# EasyEDA Pro project ProPrj_承载我所有幻想的键盘_2025-02-09.epro, schematic 09-Schematic

## Sheets
1 ESP32主控: Create Date: 2024-07-23; Page Name: ESP32主控; Project Name: 智能旋钮; Schematic Name: 主控板_小功率_S3_3; Update Date: 2024-07-23; Company: 嘉立创EDA
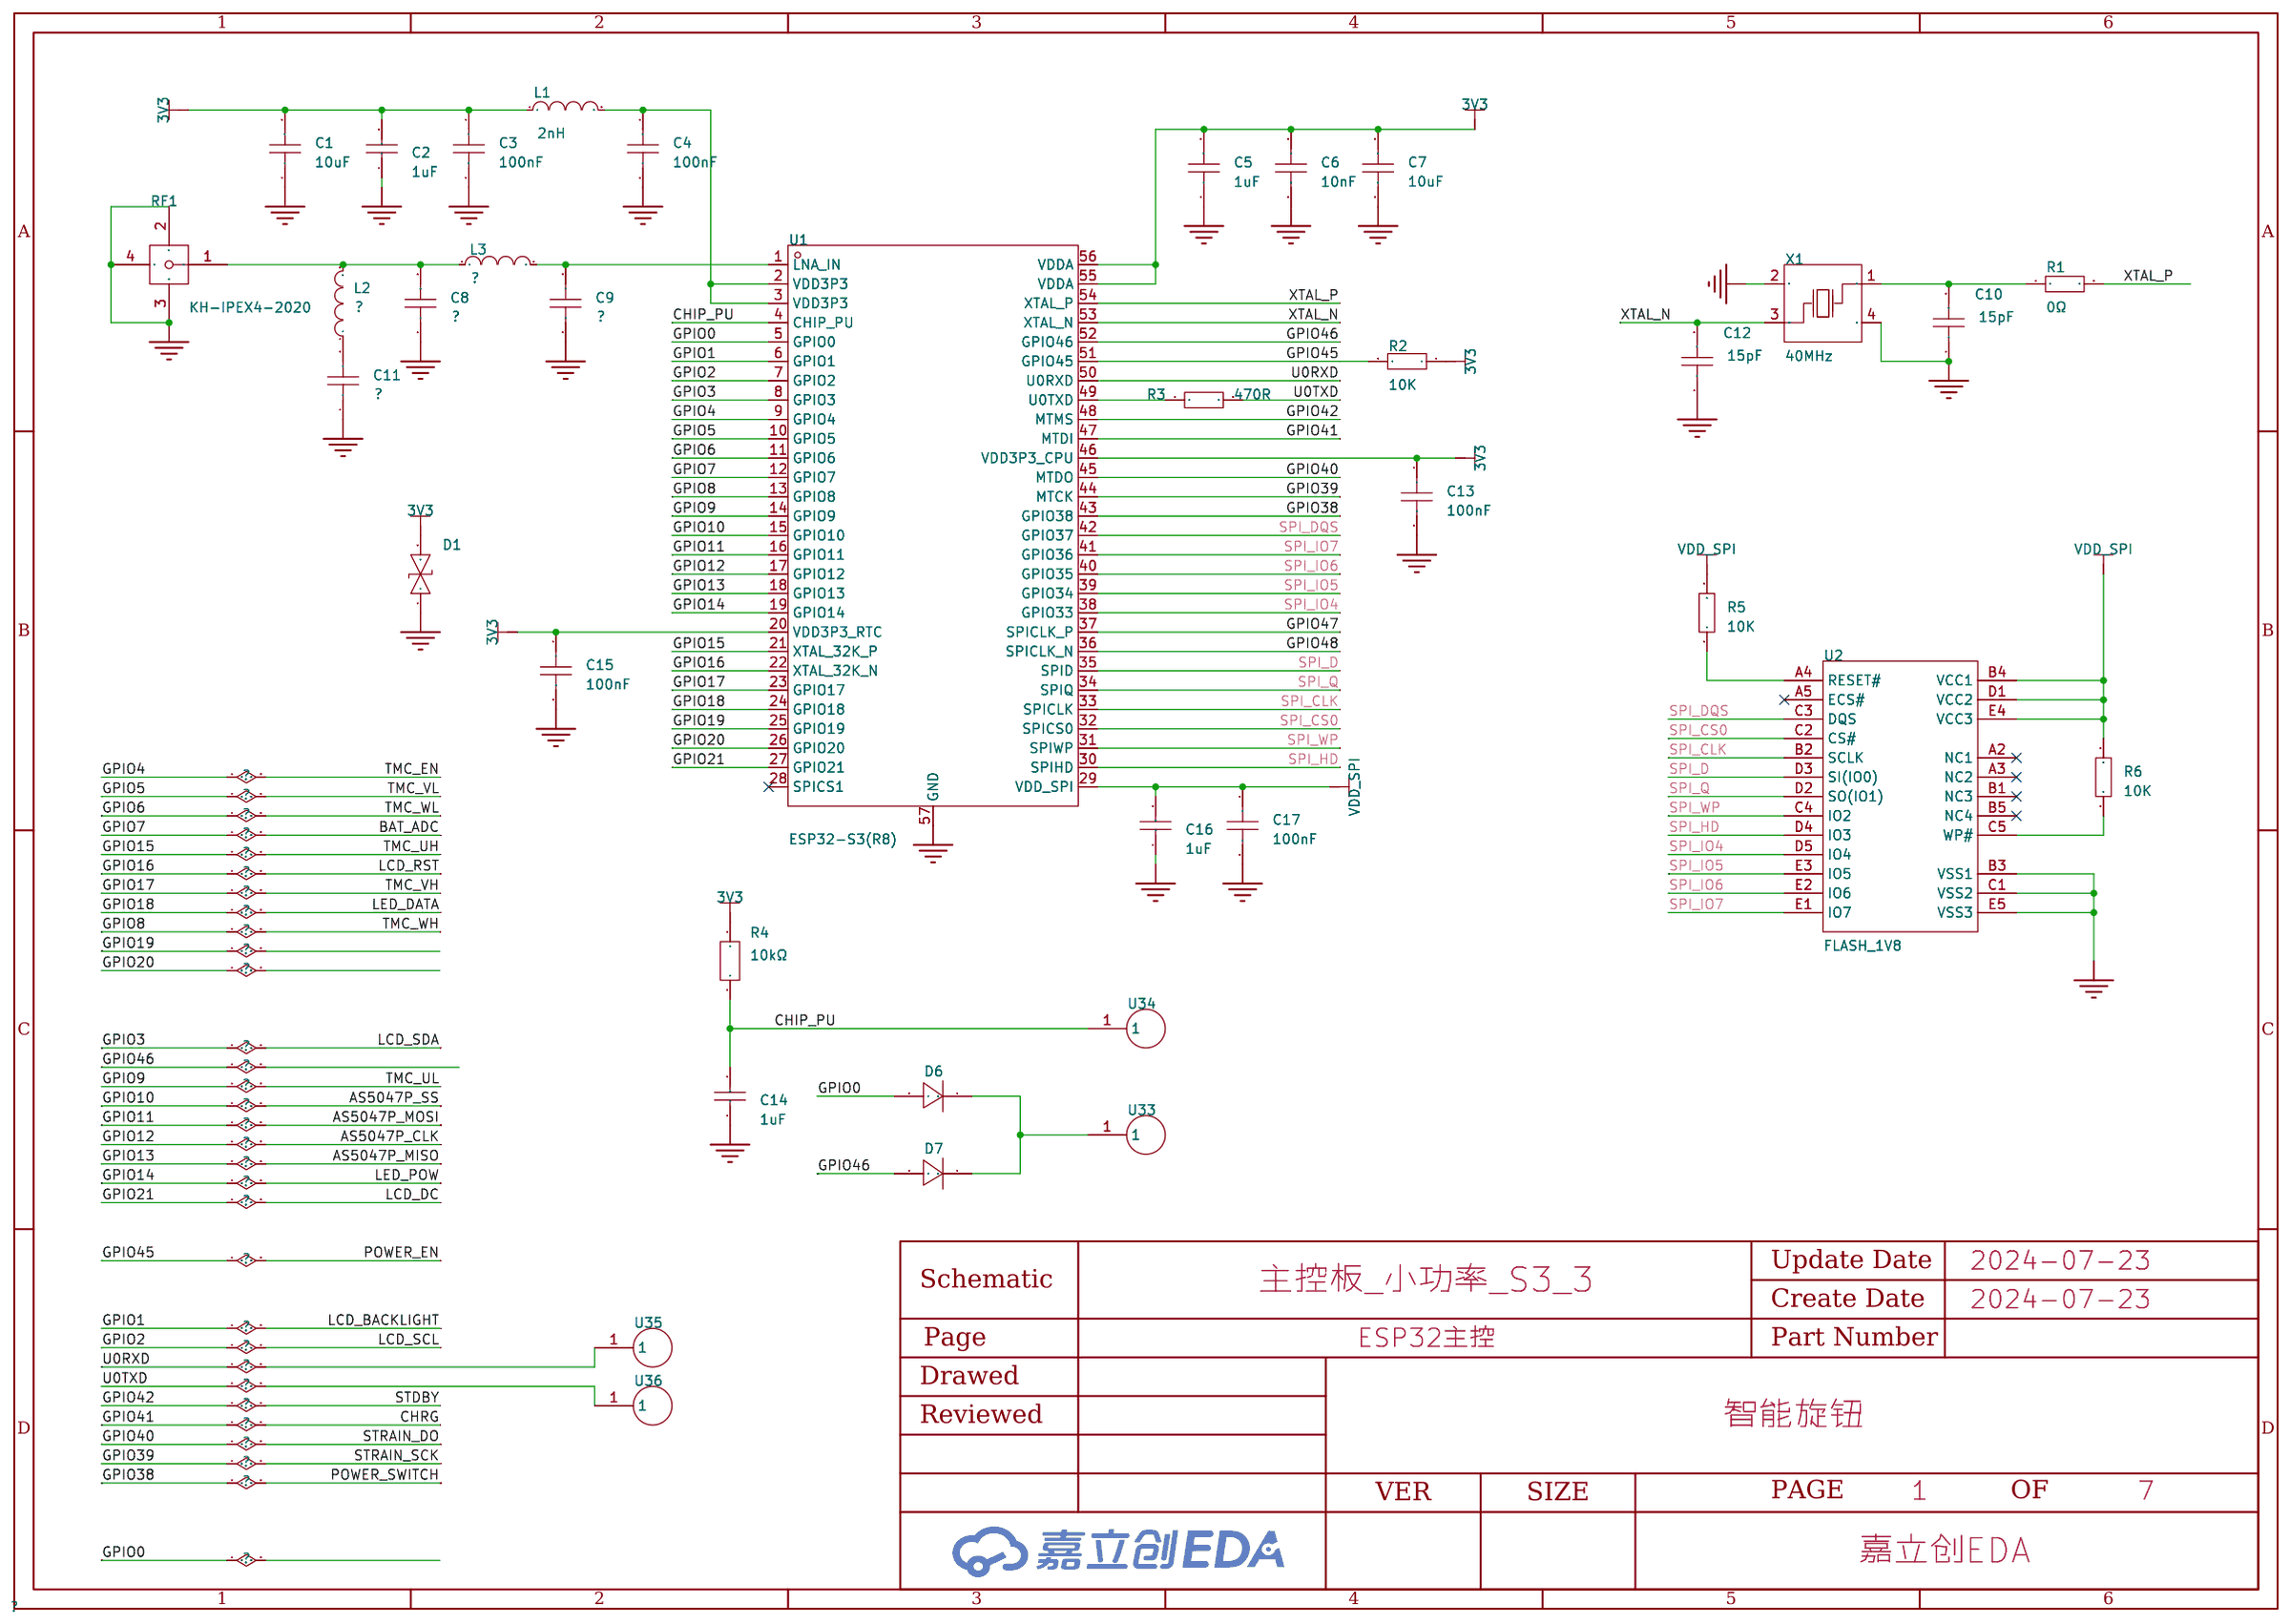
[diagram p16: ESP32主控]
2 FOC无刷电机驱动: Create Date: 2024-03-25; Page Name: FOC无刷电机驱动; Schematic Name: 主控板_小功率_S3_2; Update Date: 2024-03-25
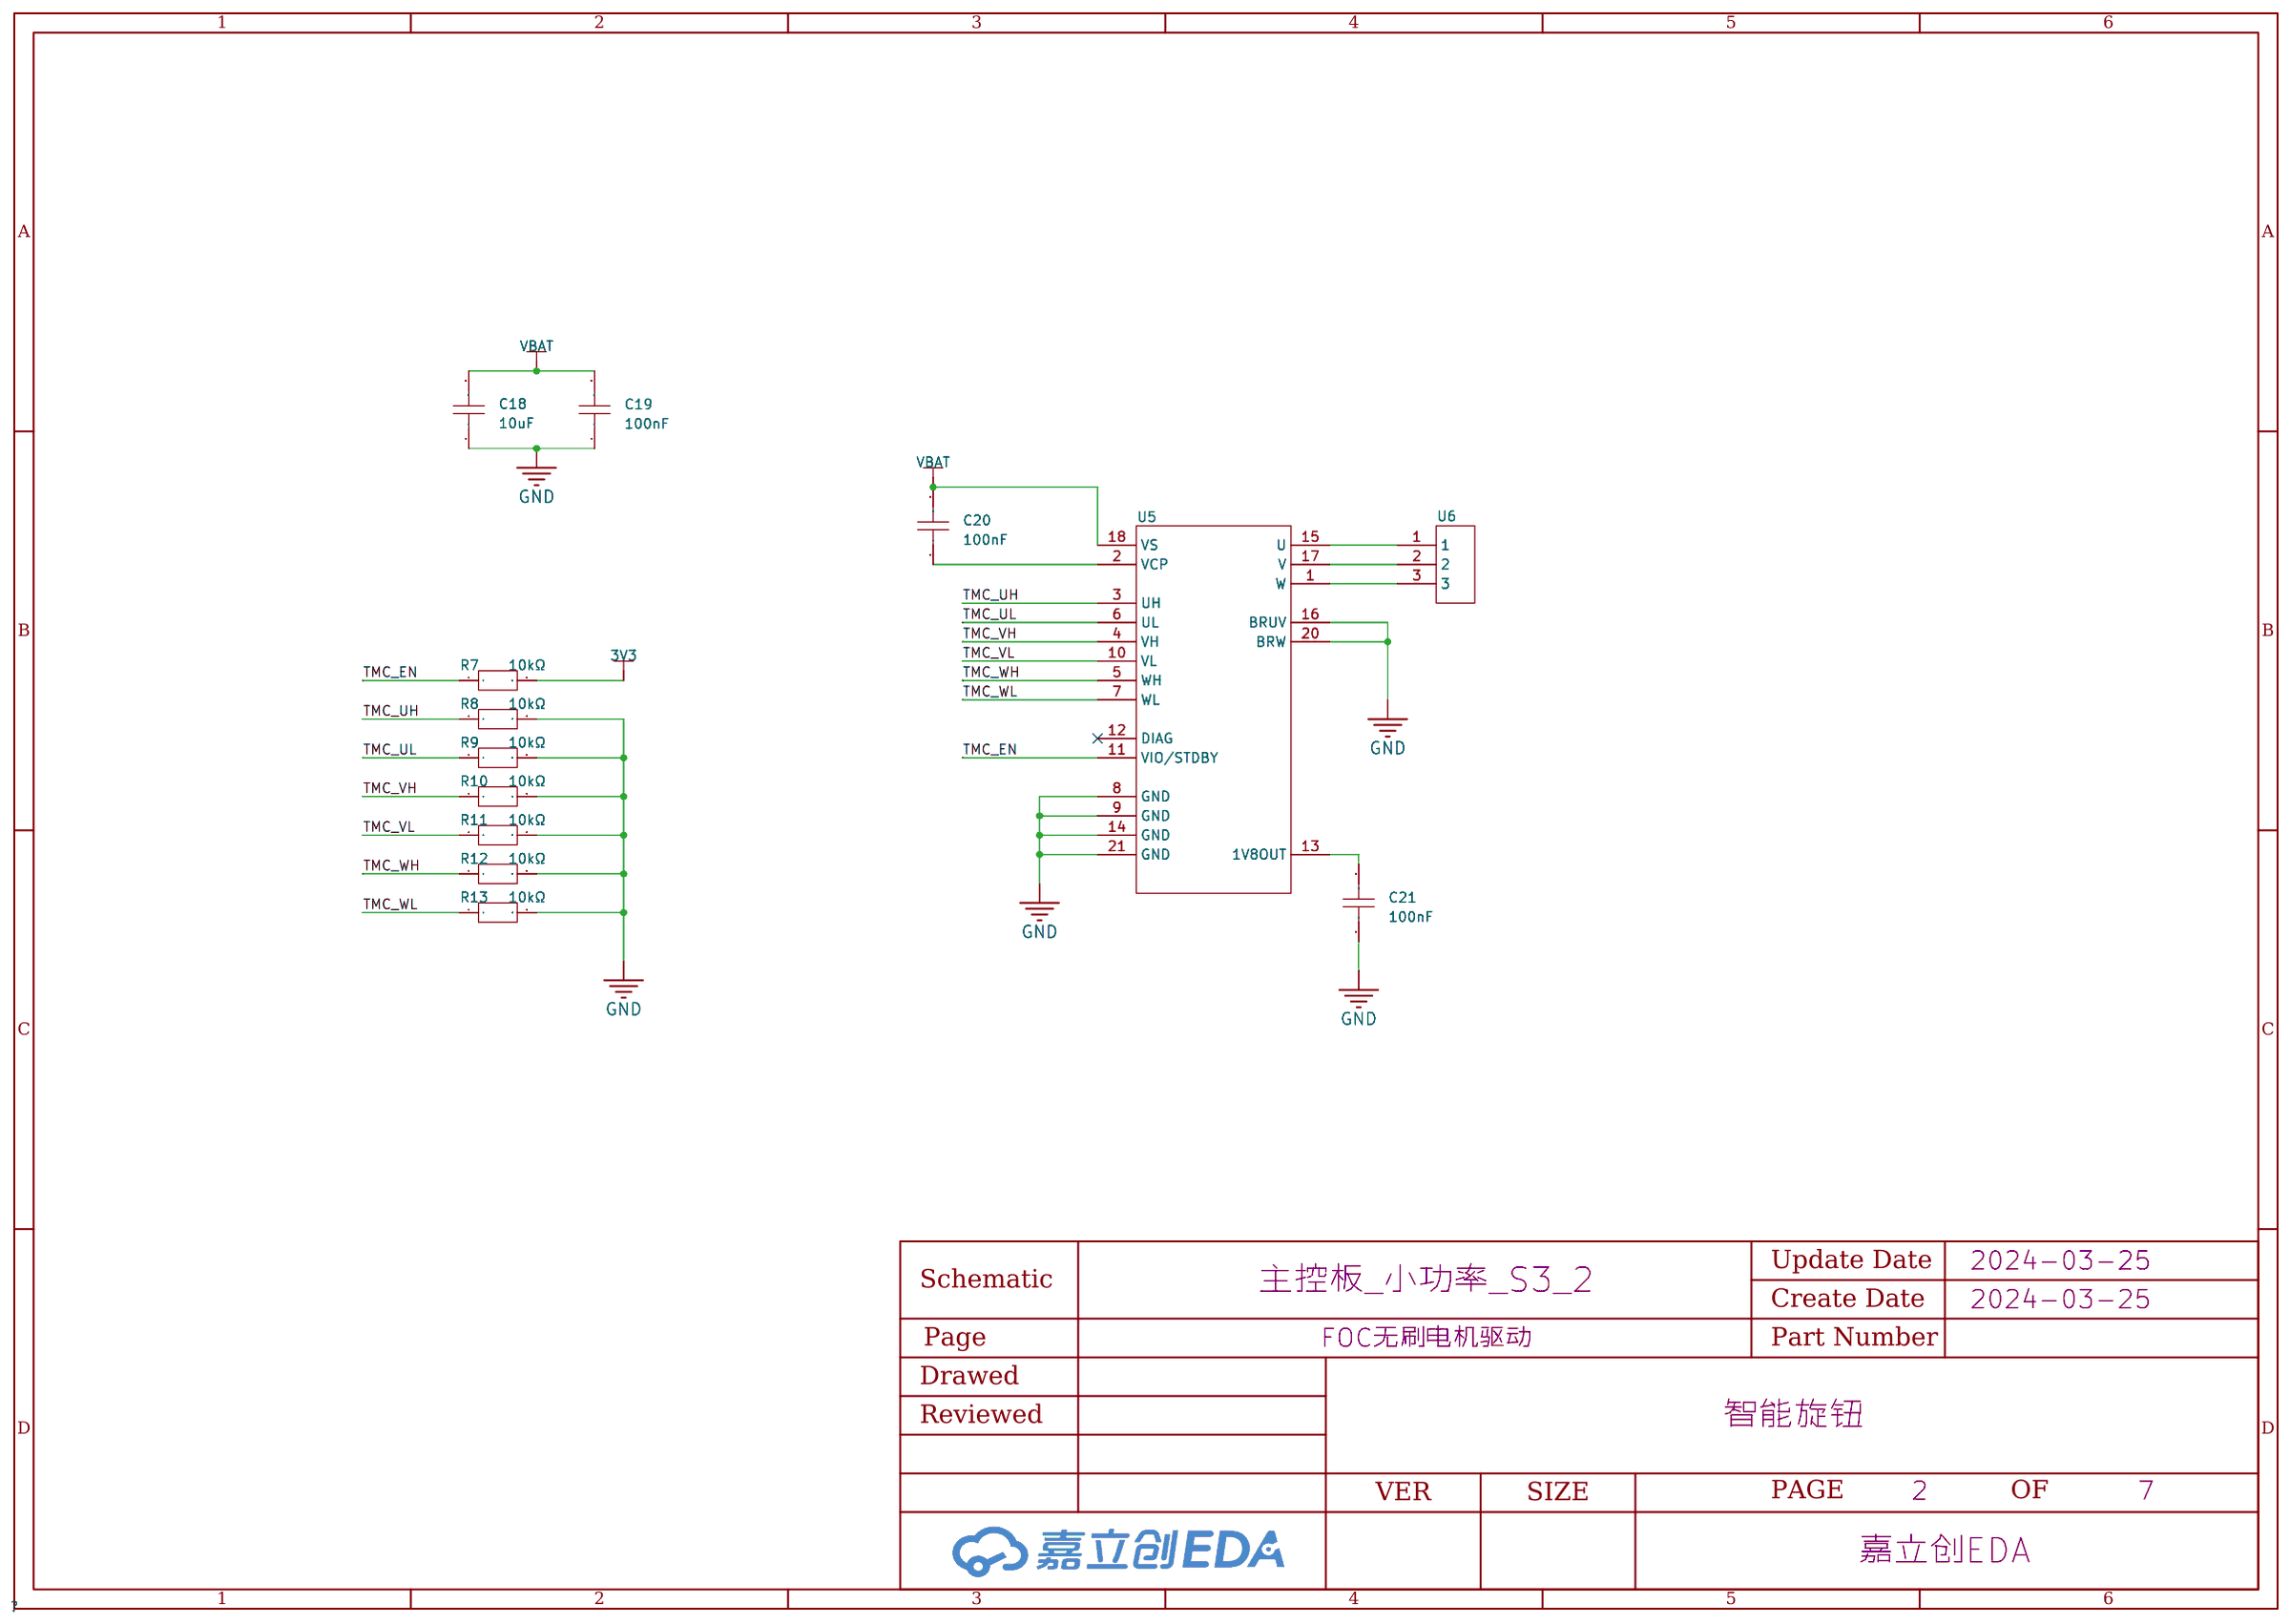
[diagram p17: FOC无刷电机驱动]
3 显示: Create Date: 2024-03-25; Page Name: 显示; Schematic Name: 主控板_小功率_S3_2; Update Date: 2024-04-06
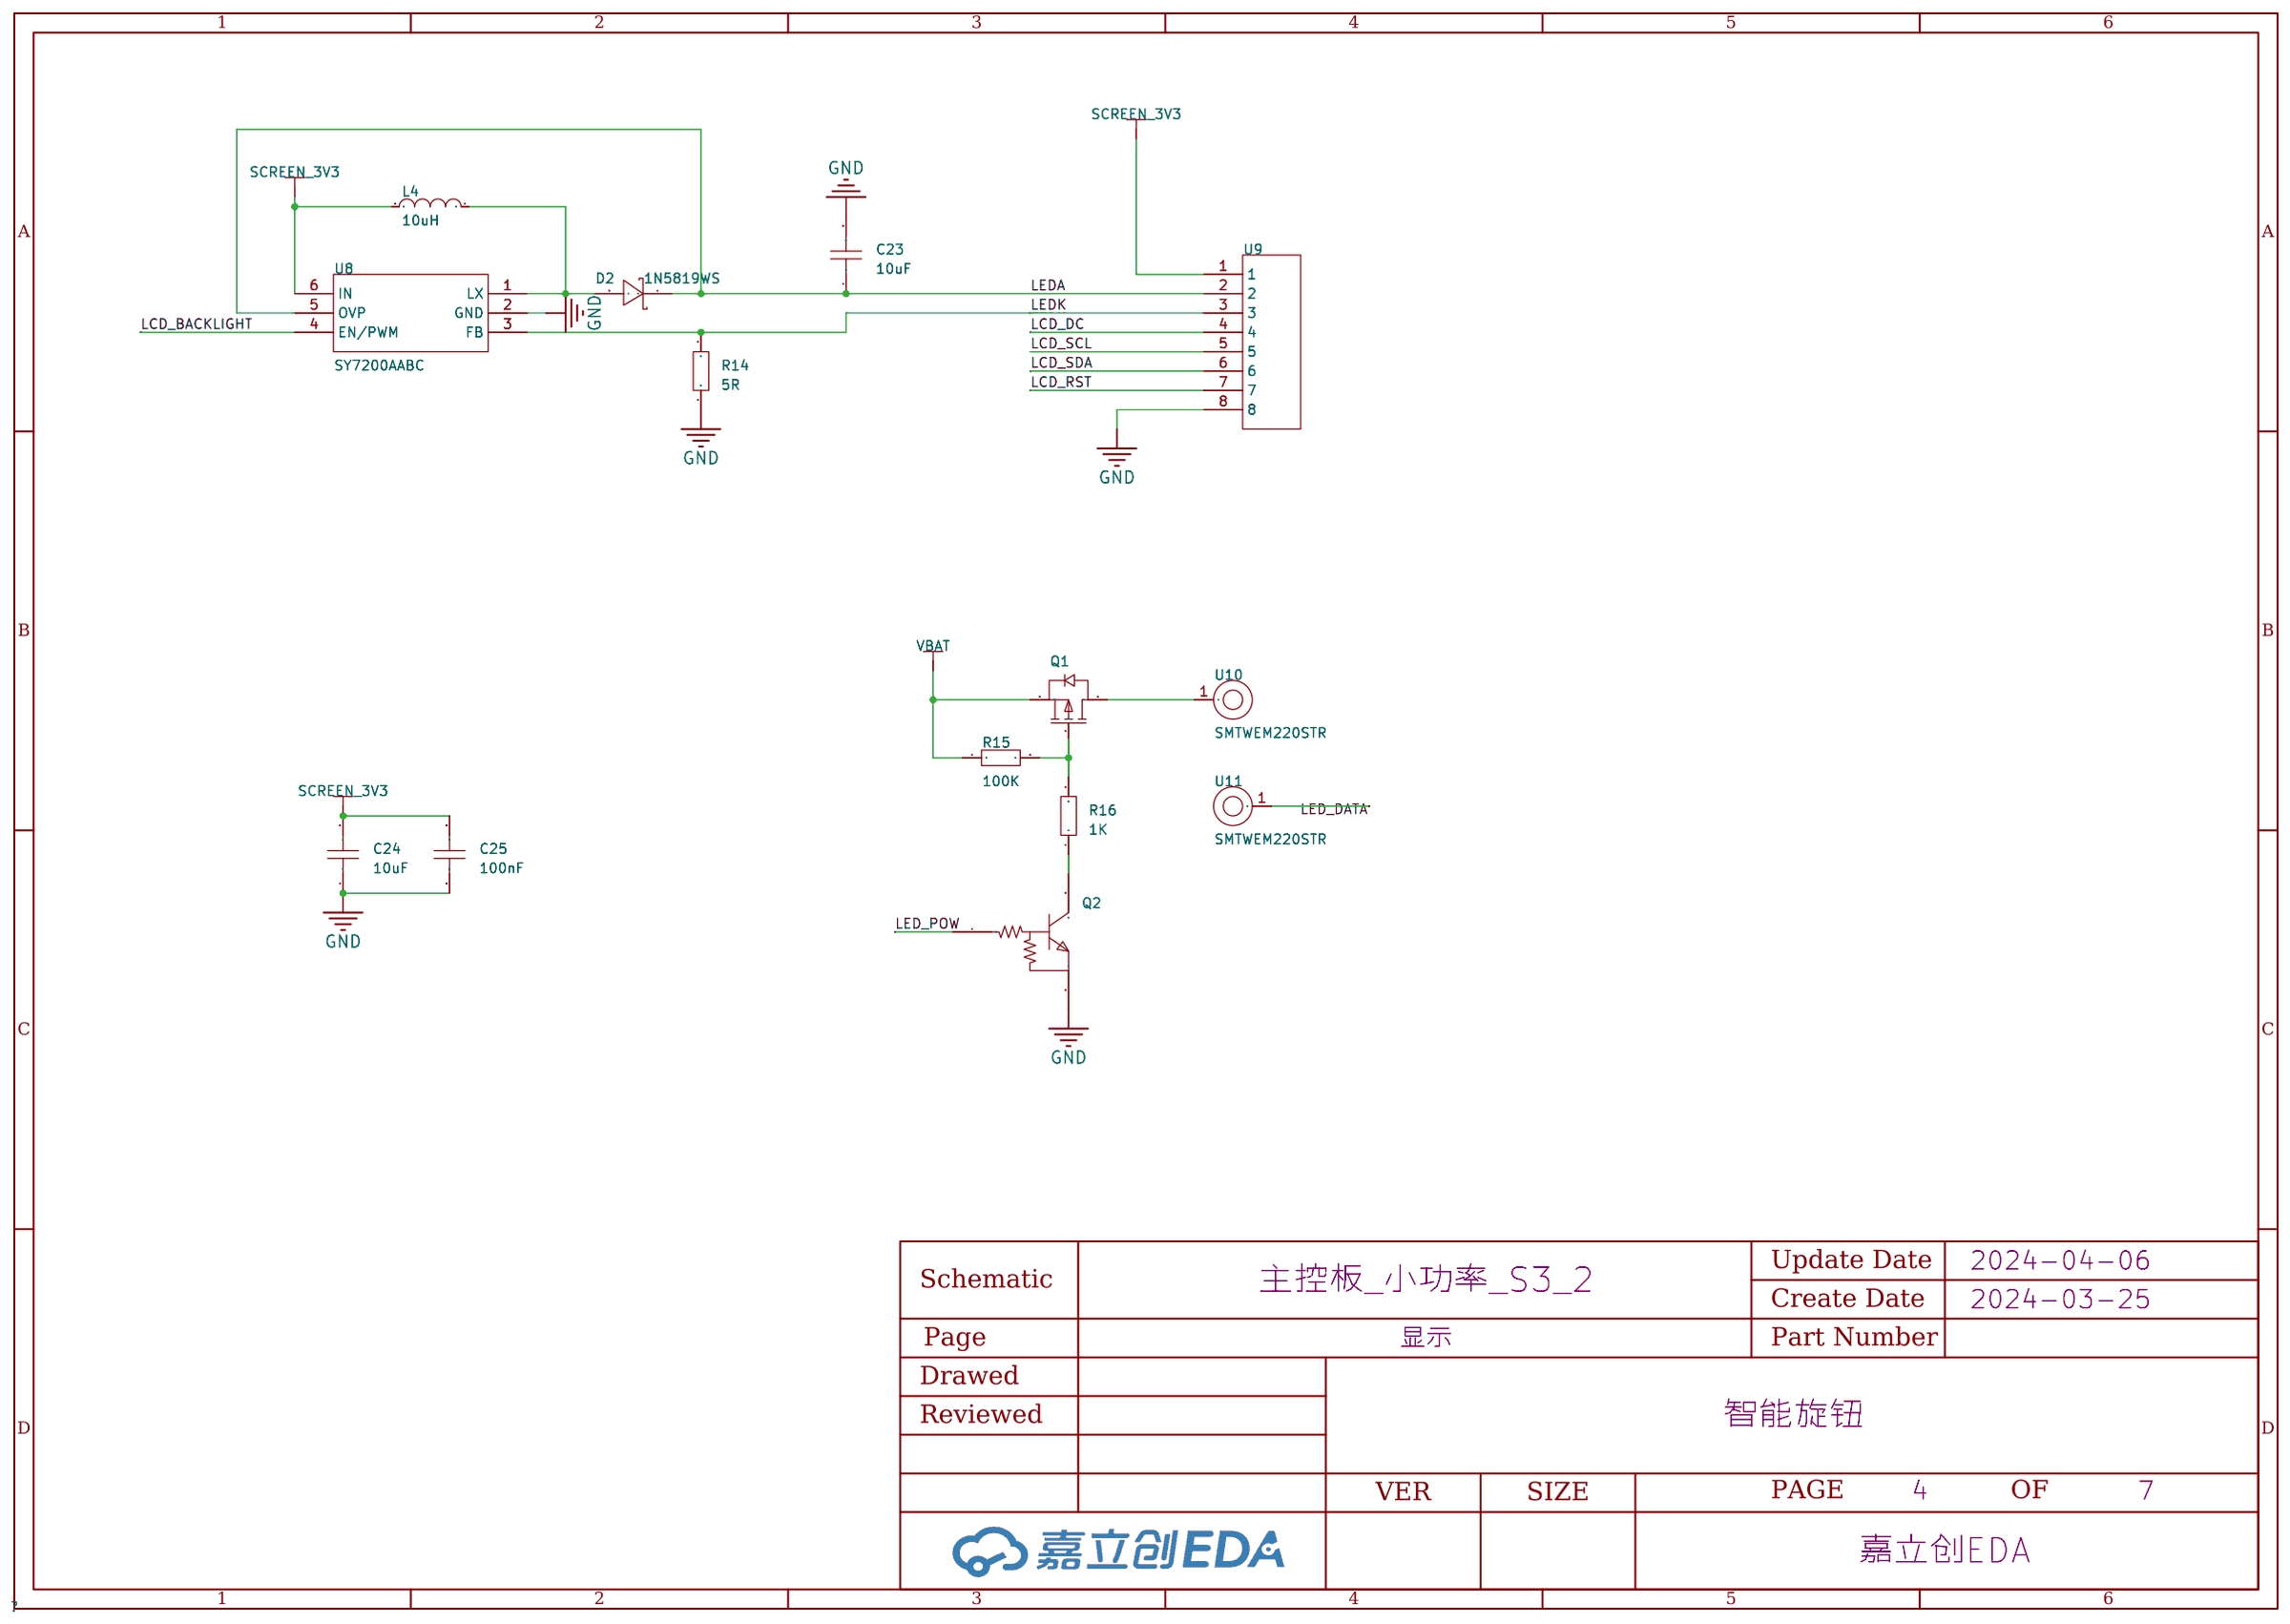
[diagram p18: 显示]
4 电源: Create Date: 2024-08-04; Page Name: 电源; Project Name: 承载我所有幻想的键盘; Schematic Name: 09-Schematic; Update Date: 2024-08-04
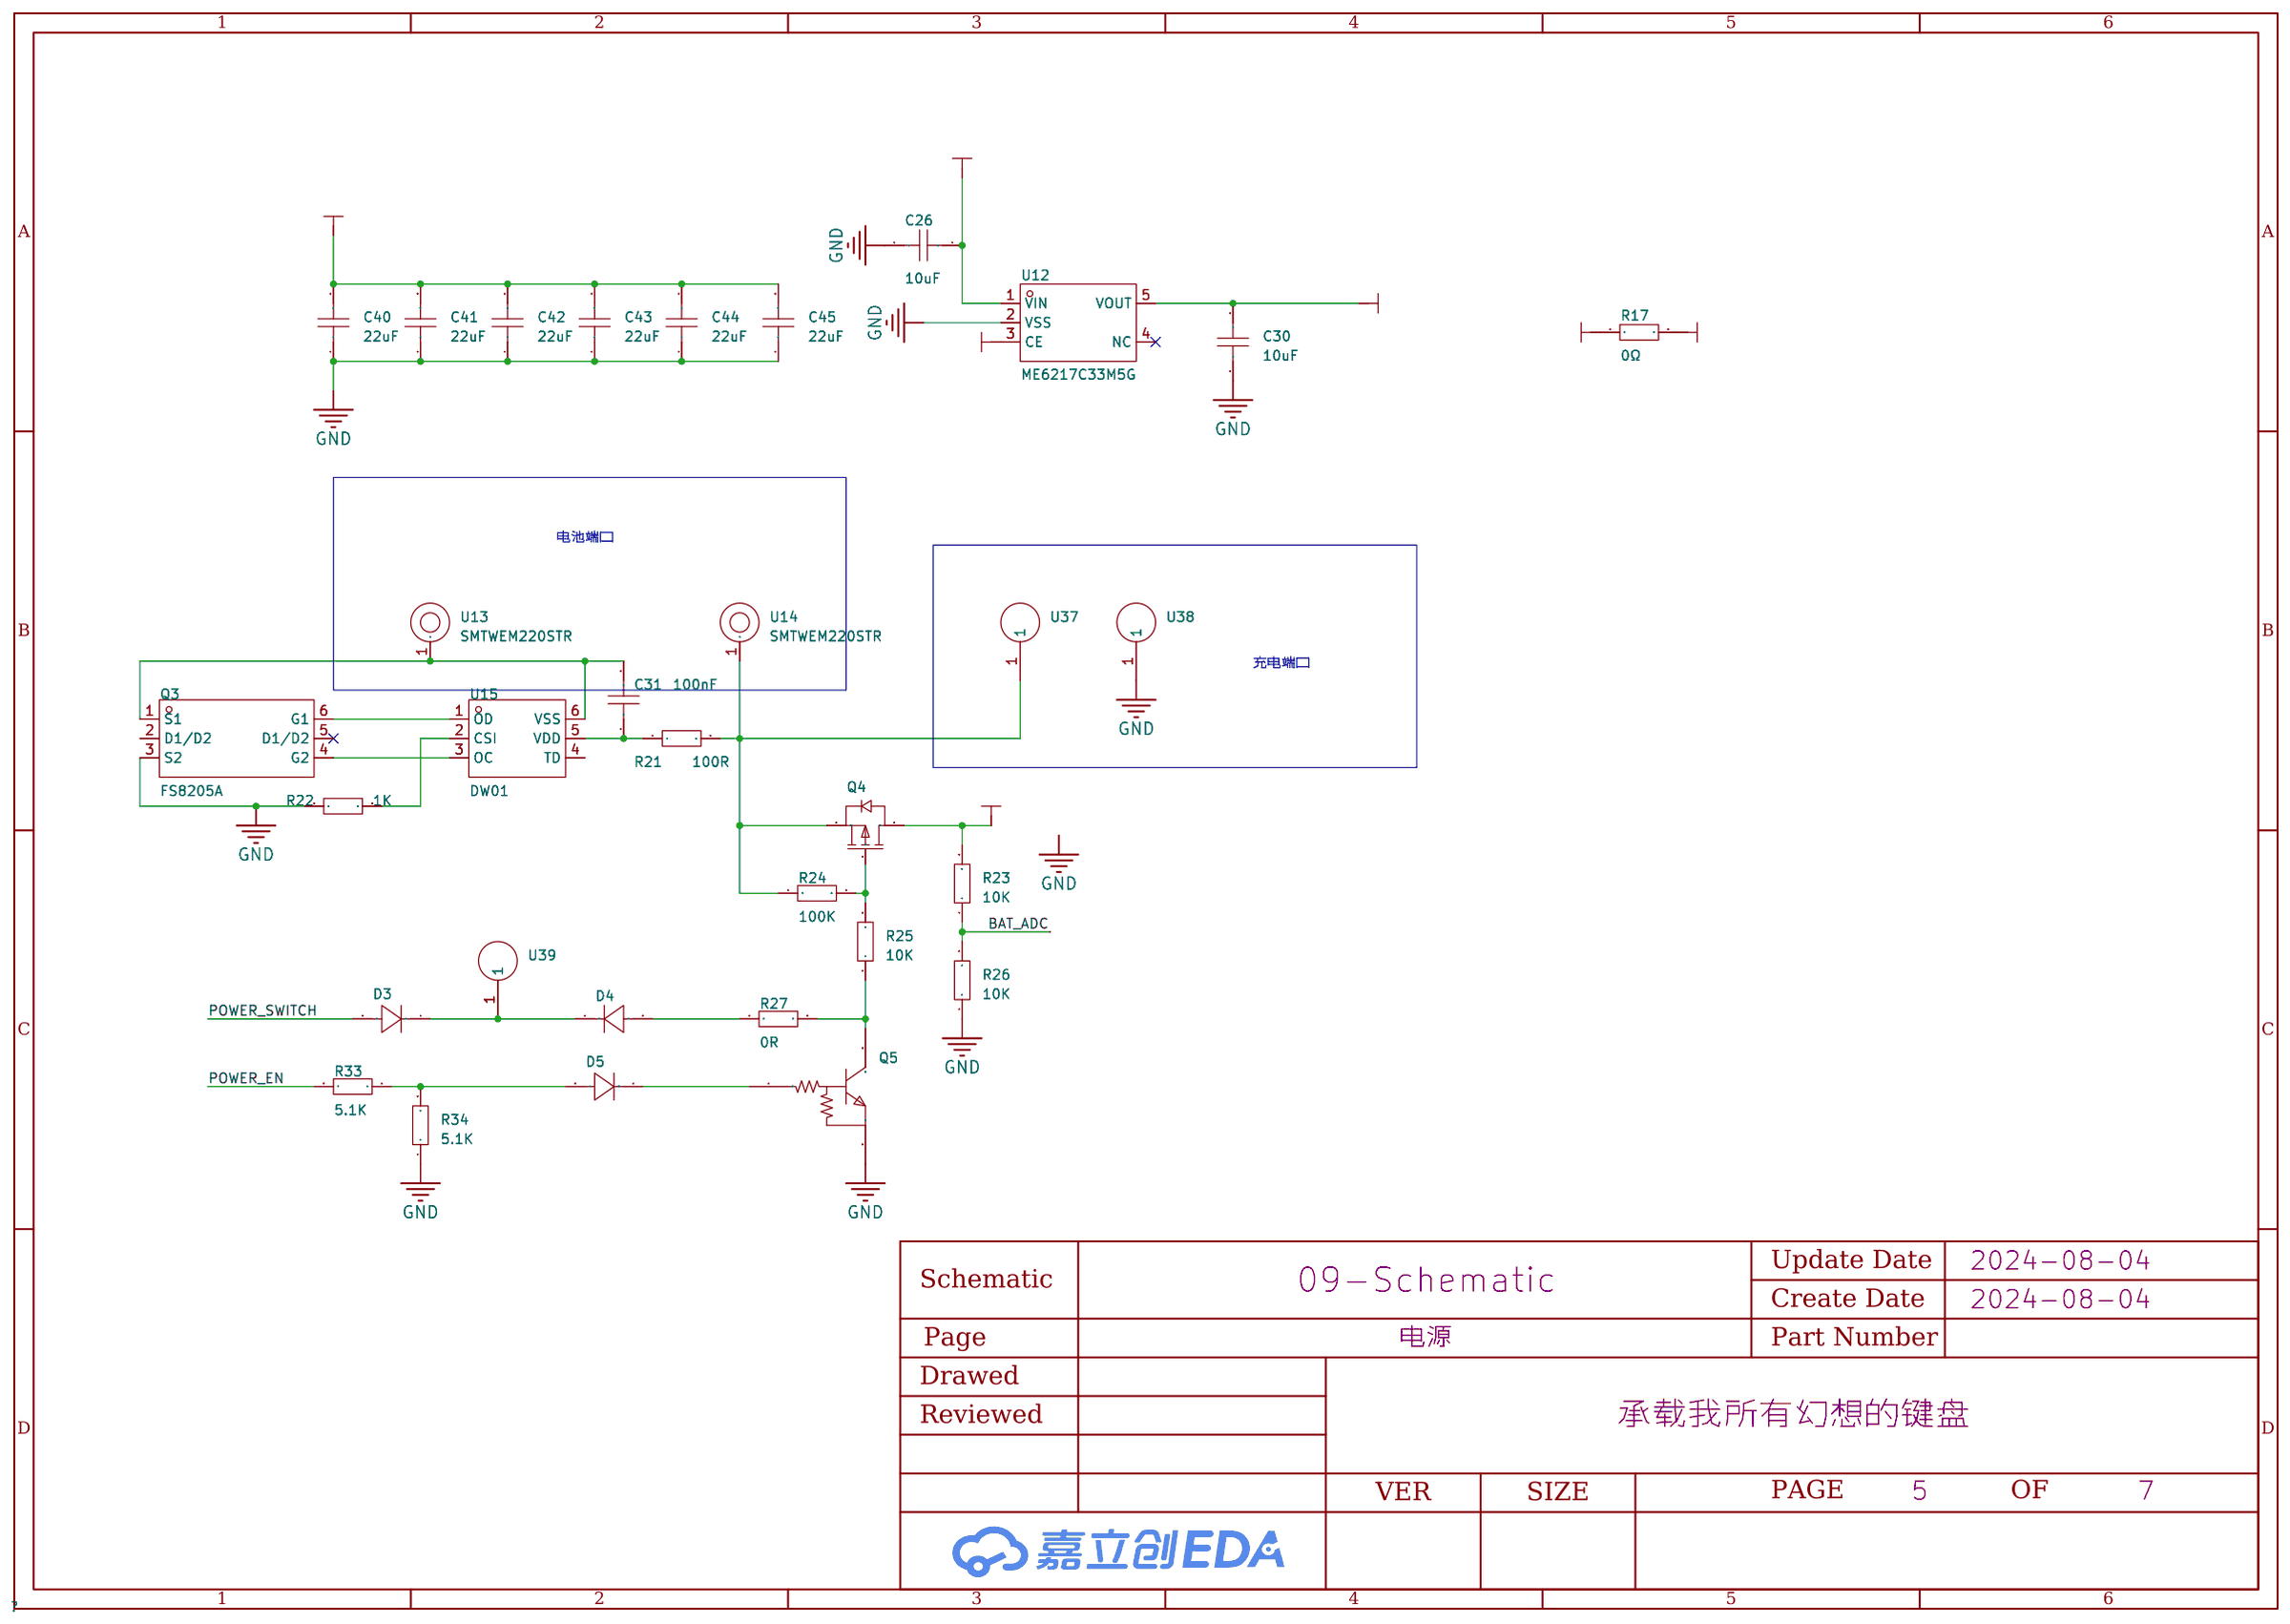
[diagram p19: 电源]
5 编码器: Create Date: 2024-03-25; Page Name: 编码器; Schematic Name: 主控板_小功率_S3_2; Update Date: 2024-03-25
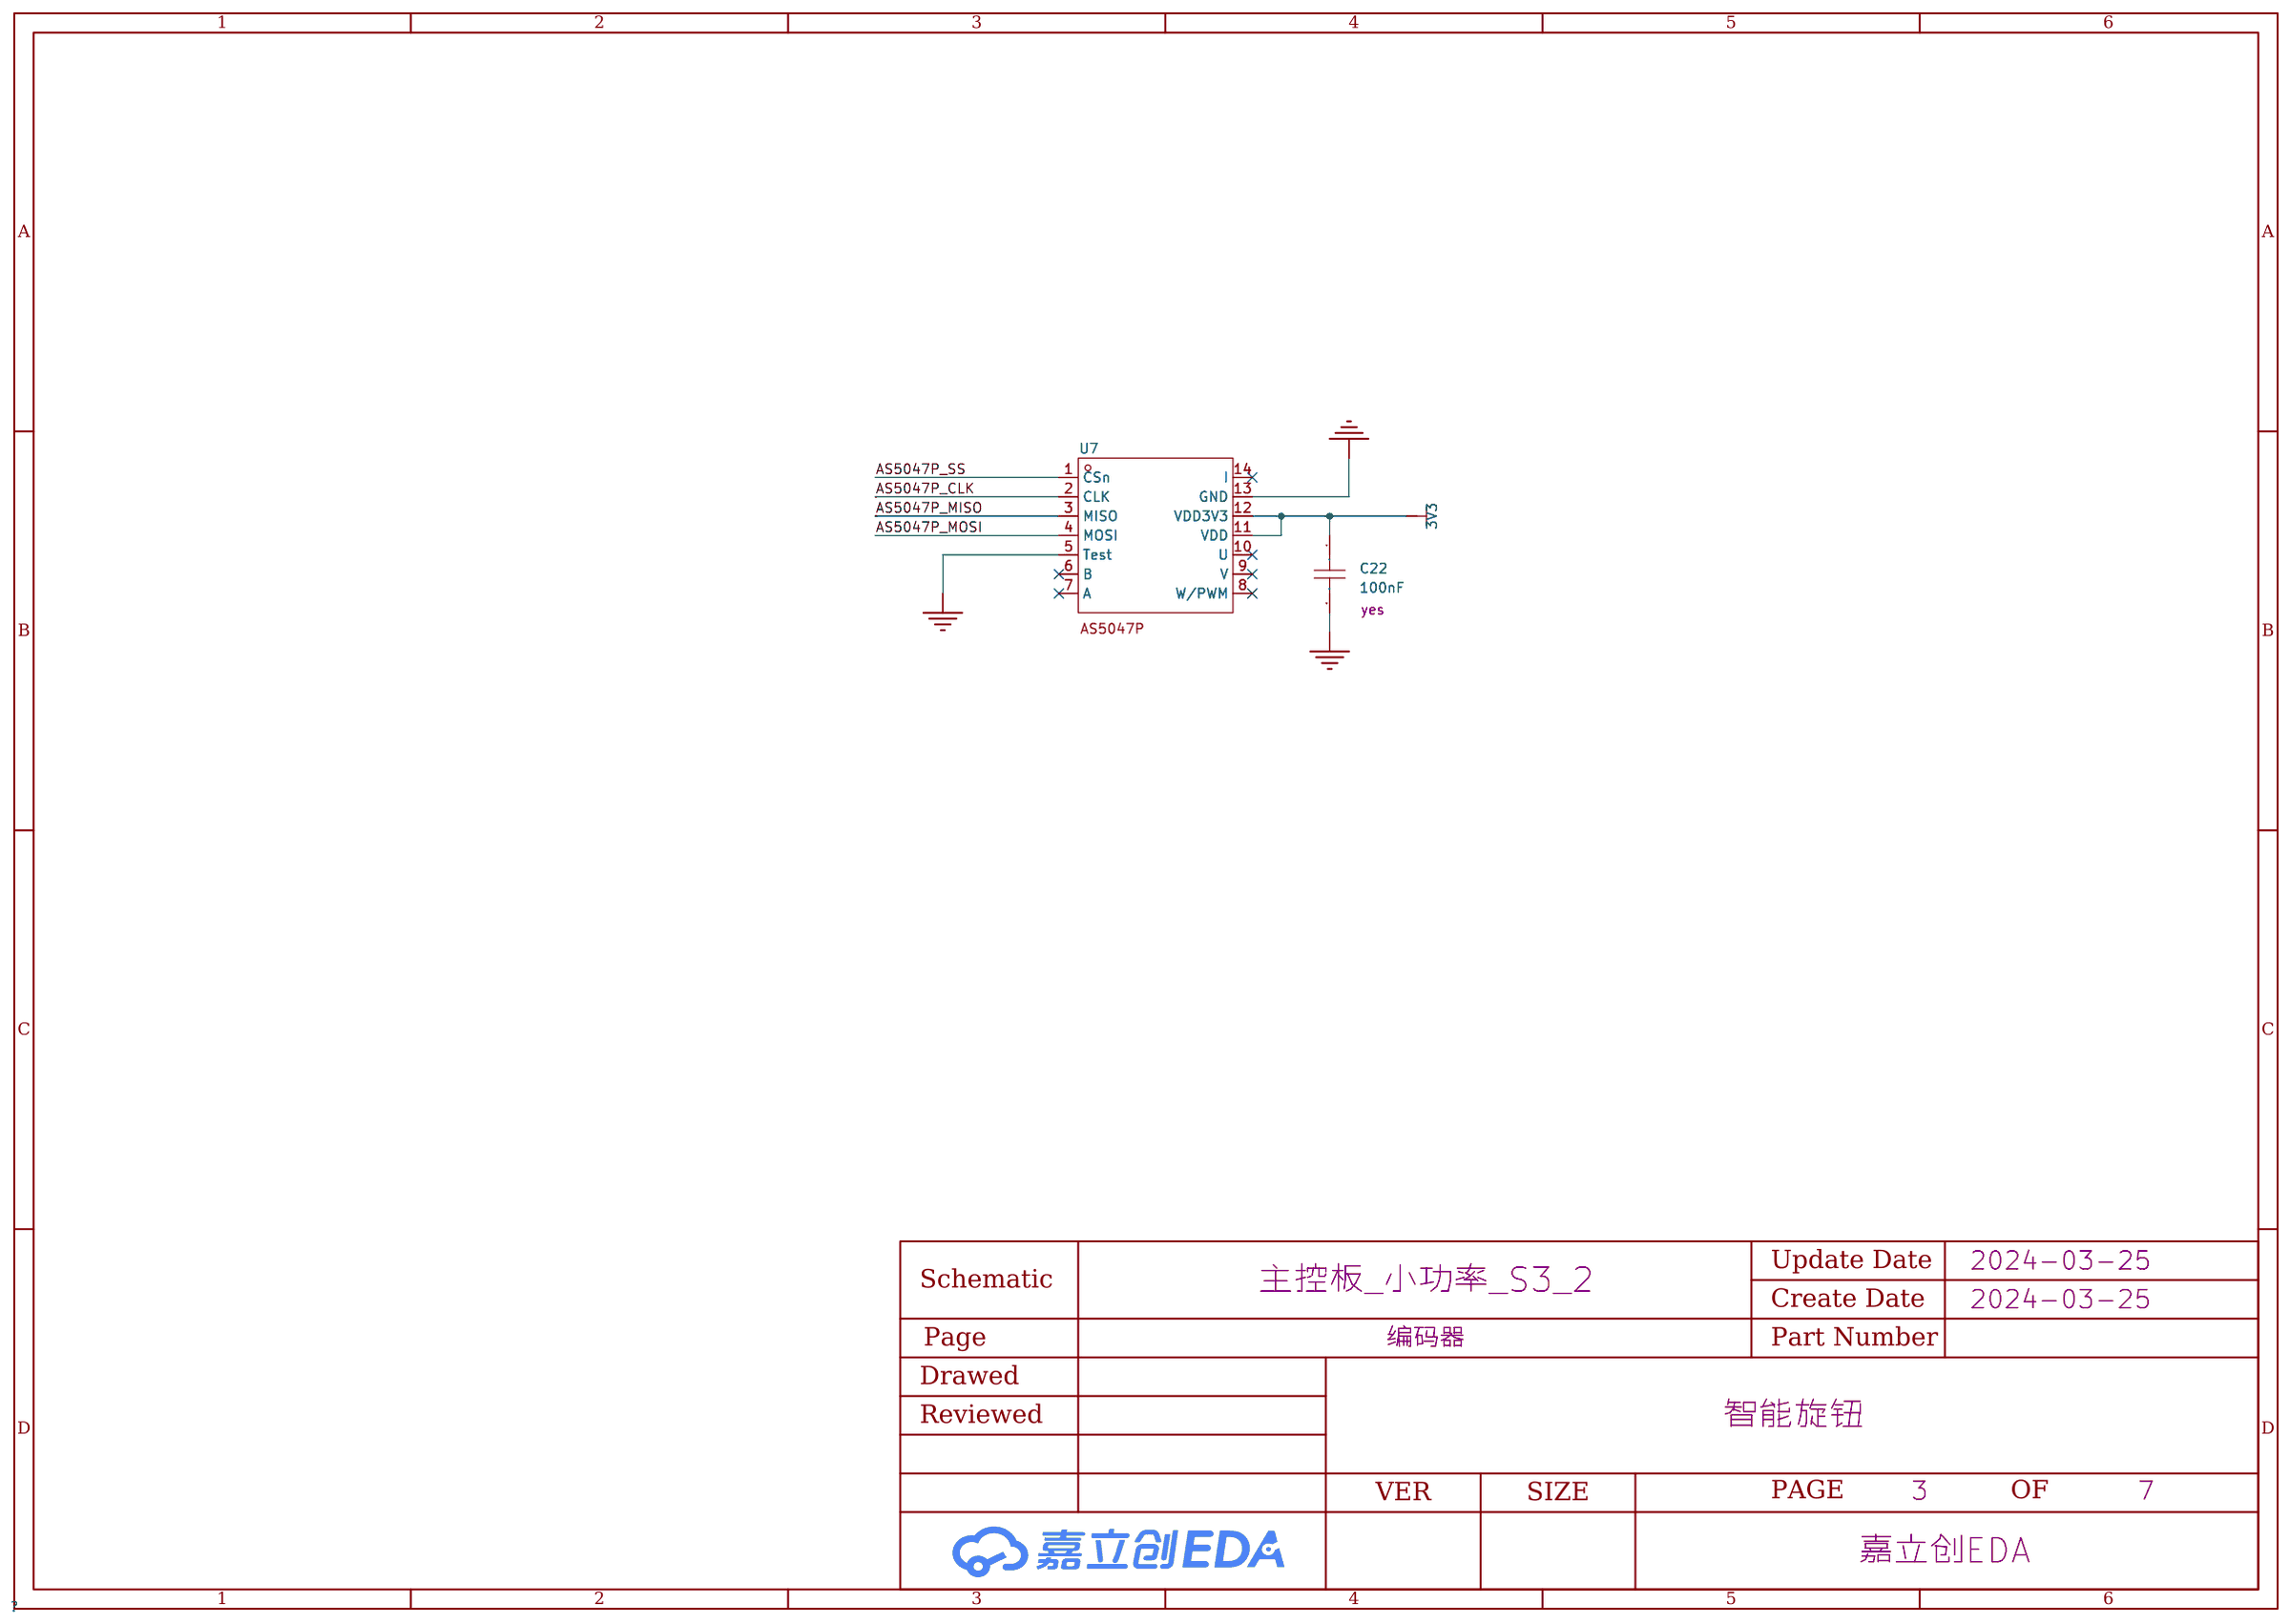
[diagram p20: 编码器]
6 压力传感器: Create Date: 2024-03-25; Page Name: 压力传感器; Schematic Name: 主控板_小功率_S3_2; Update Date: 2024-03-25
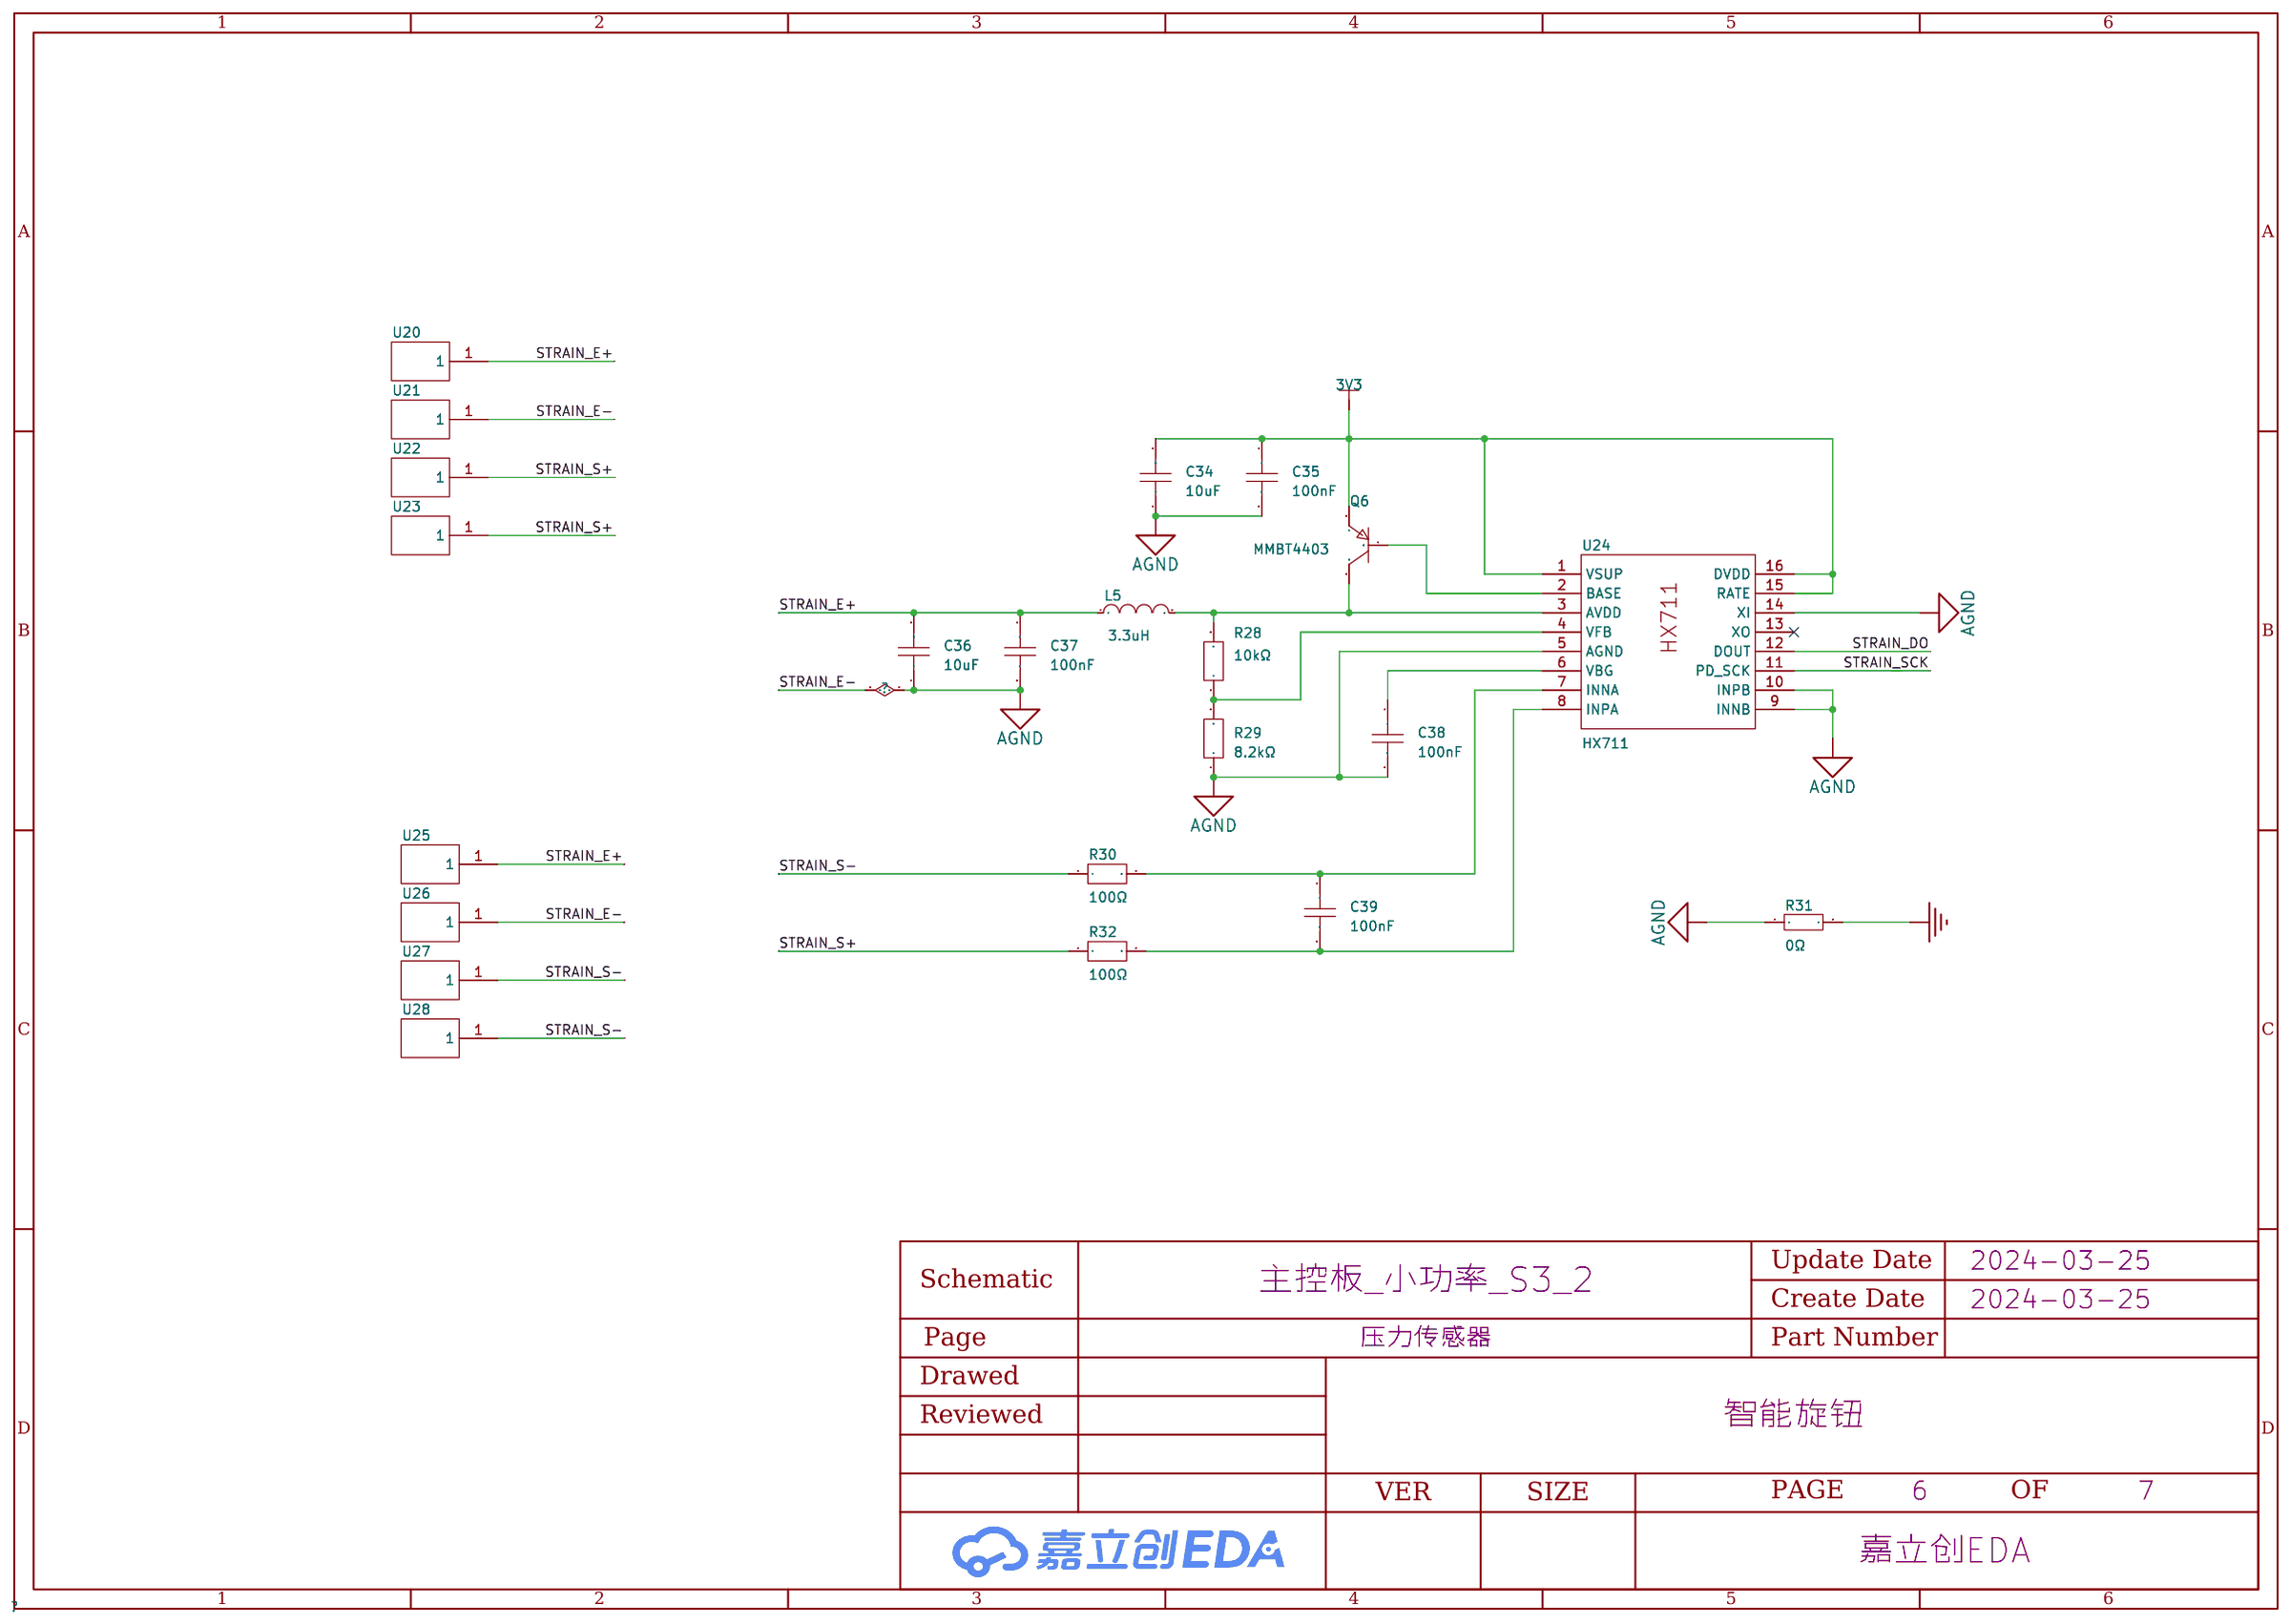
[diagram p21: 压力传感器]
7 3D外壳: Create Date: 2024-08-04; Page Name: 3D外壳; Project Name: 承载我所有幻想的键盘; Schematic Name: 09-Schematic; Update Date: 2024-08-04
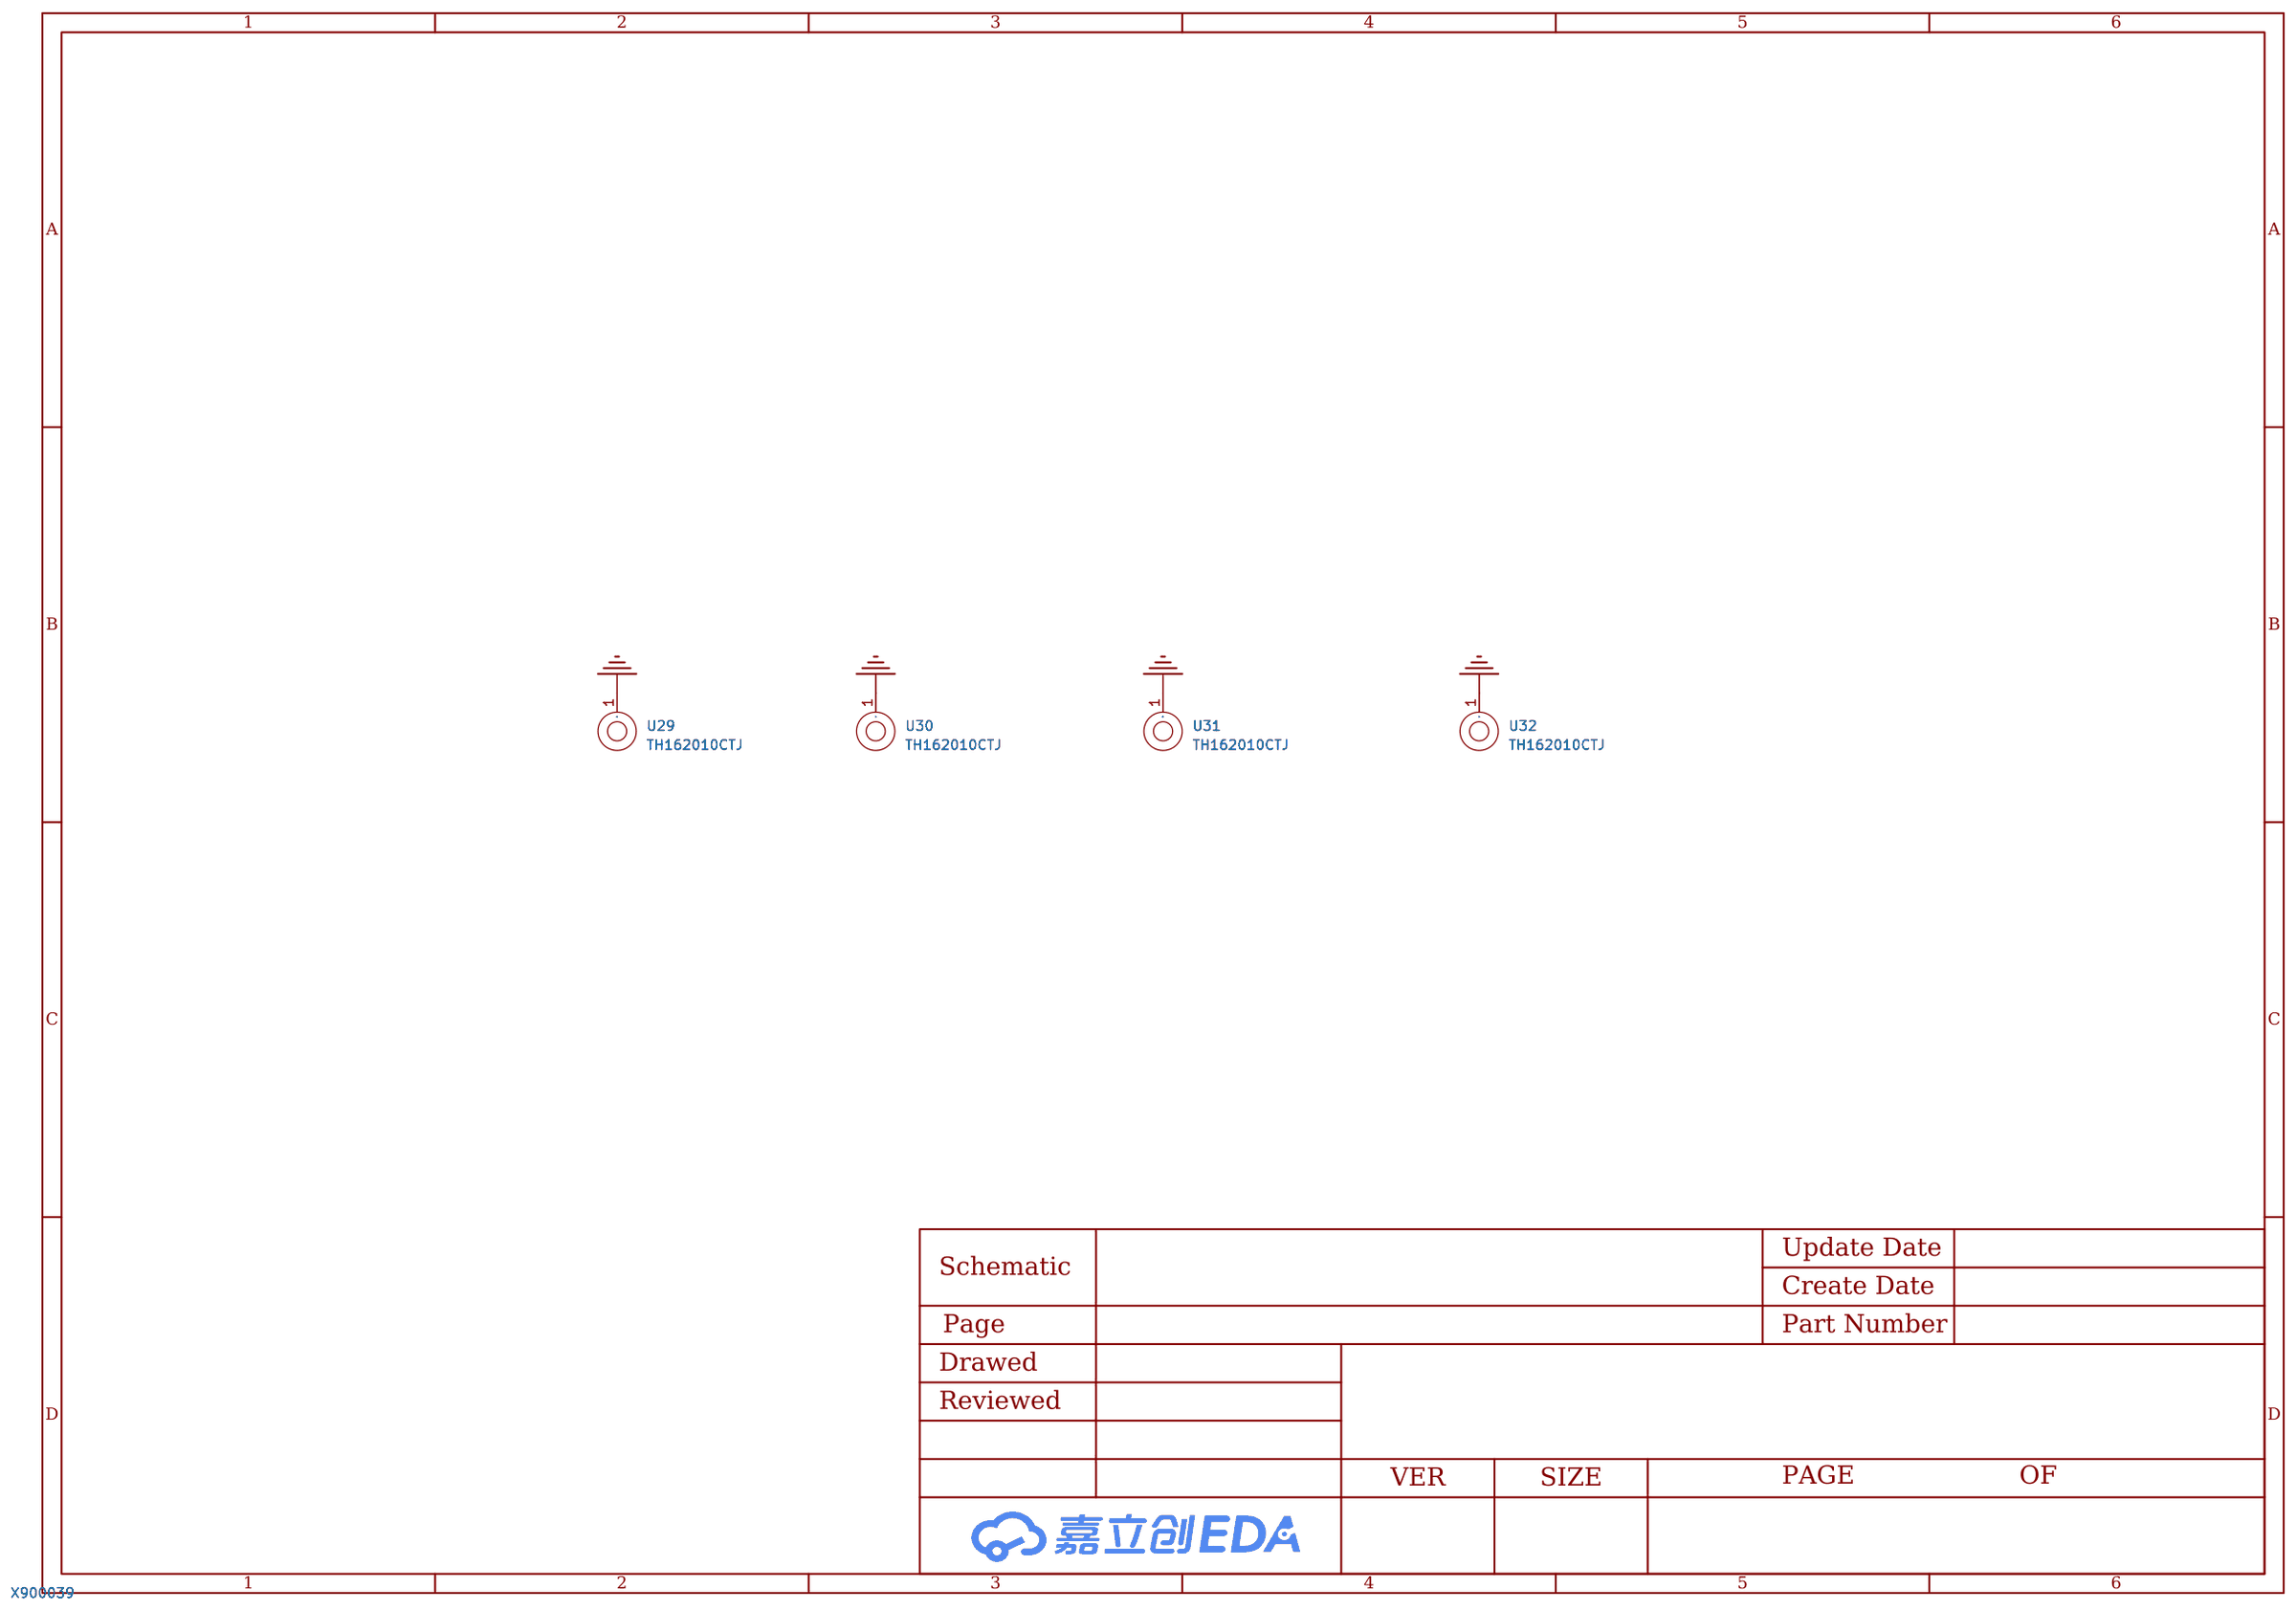
[diagram p22: 3D外壳]

## Parts
sheet 3D外壳
U29  TH162010CTJ  [SMD-1_BD4.4-D2.8]
U30  TH162010CTJ  [SMD-1_BD4.4-D2.8]
U31  TH162010CTJ  [SMD-1_BD4.4-D2.8]
U32  TH162010CTJ  [SMD-1_BD4.4-D2.8]
sheet ESP32主控
C1  10uF  [C0402]
C2  1uF  [C0201]
C3  100nF  [C0201]
C4  100nF  [C0201]
C5  1uF  [C0402]
C6  10nF  [C0402]
C7  10uF  [C0402]
C8  ？  [C0201]
C9  ？  [C0201]
C10  15pF  [C0402]
C11  ？  [C0201]
C12  15pF  [C0402]
C13  100nF  [C0402]
C14  1uF  [C0402]
C15  100nF  [C0402]
C16  1uF  [C0402]
C17  100nF  [C0402]
D1  LESD8D3.3CAT5G  [SOD-882_L1.0-W0.6-BI]
D6  1N4148WT  [SOD-523_L1.2-W0.8-LS1.6-RD]
D7  1N4148WT  [SOD-523_L1.2-W0.8-LS1.6-RD]
L1  2nH  [L0201]
L2  ？  [L0201]
L3  ？  [L0201]
R1  0Ω  [R0402]
R2  10K  [R0402]
R3  470R  [R0402]
R4  10kΩ  [R0402]
R5  10K  [R0402]
R6  10K  [R0402]
RF1  KH-IPEX4-2020  [IPEX4-SMD_4P-L1.8-W1.7-LS2.0-L_KH-IPEX4-2020]
U1  ESP32-S3(R8)  [QFN-56_L7.0-W7.0-P0.40-TL-EP4.0]
U2  FLASH_1V8  [BGA25-6X8-1P0]
U33  -  [2MM POGPIN母座]
U34  -  [2MM POGPIN母座]
U35  -  [2MM POGPIN母座]
U36  -  [2MM POGPIN母座]
X1  40MHz  [OSC-SMD_4P-L3.2-W2.5-BL_SIT8008BI]
sheet FOC无刷电机驱动
C18  10uF  [C0402]
C19  100nF  [C0402]
C20  100nF  [C0402]
C21  100nF  [C0402]
R7  10kΩ  [R0402]
R8  10kΩ  [R0402]
R9  10kΩ  [R0402]
R10  10kΩ  [R0402]
R11  10kΩ  [R0402]
R12  10kΩ  [R0402]
R13  10kΩ  [R0402]
U5  -  [QFN-20_L3.0-W3.0-P0.50-BL-EP1.7]
U6  -  [3Pin焊接接口]
sheet 压力传感器
C34  10uF  [C0402]
C35  100nF  [C0402]
C36  10uF  [C0402]
C37  100nF  [C0402]
C38  100nF  [C0402]
C39  100nF  [C0402]
L5  3.3uH  [L0805]
Q6  MMBT4403  [SOT-23-3_L2.9-W1.3-P1.90-LS2.4-BR]
R28  10kΩ  [R0402]
R29  8.2kΩ  [R0402]
R30  100Ω  [R0402]
R31  0Ω  [R0402]
R32  100Ω  [R0402]
U20  -  [1P焊接接口]
U21  -  [1P焊接接口]
U22  -  [1P焊接接口]
U23  -  [1P焊接接口]
U24  HX711  [SOP-16_L10.0-W3.9-P1.27-LS6.0-BL]
U25  -  [1P焊接接口]
U26  -  [1P焊接接口]
U27  -  [1P焊接接口]
U28  -  [1P焊接接口]
sheet 显示
C23  10uF  [C0402]
C24  10uF  [C0402]
C25  100nF  [C0402]
D2  1N5819WS  [SOD-323_L1.8-W1.3-LS2.5-RD]
L4  10uH  [IND-SMD_L2.5-W2.0]
Q1  3401  [SOT-23-3_L2.9-W1.3-P1.90-LS2.4-BR]
Q2  LMUN2212LT1G  [SOT-23-3_L2.9-W1.3-P1.90-LS2.4-BR]
R14  5R  [R0402]
R15  100K  [R0402]
R16  1K  [R0402]
U8  SY7200AABC  [SOT-23-6_L2.9-W1.6-P0.95-LS2.8-BR]
U9  -  [屏幕焊线接口2]
U10  SMTWEM220STR  [SMD-1_BD4.4-D2.8]
U11  SMTWEM220STR  [SMD-1_BD4.4-D2.8]
sheet 电源
C26  10uF  [C0402]
C30  10uF  [C0402]
C31  100nF  [C0402]
C40  22uF  [C0402]
C41  22uF  [C0402]
C42  22uF  [C0402]
C43  22uF  [C0402]
C44  22uF  [C0402]
C45  22uF  [C0402]
D3  1N4148WS  [SOD-323_L1.8-W1.3-LS2.5-RD]
D4  1N4148WS  [SOD-323_L1.8-W1.3-LS2.5-RD]
D5  1N4148WS  [SOD-323_L1.8-W1.3-LS2.5-RD]
Q3  FS8205A  [SOT-23-6_L2.9-W1.6-P0.95-LS2.8-BR]
Q4  3401  [SOT-23-3_L2.9-W1.3-P1.90-LS2.4-BR]
Q5  LMUN2212LT1G  [SOT-23-3_L2.9-W1.3-P1.90-LS2.4-BR]
R17  0Ω  [R0402]
R21  100R  [R0402]
R22  1K  [R0402]
R23  10K  [R0402]
R24  100K  [R0402]
R25  10K  [R0402]
R26  10K  [R0402]
R27  0R  [R0402]
R33  5.1K  [R0402]
R34  5.1K  [R0402]
U12  ME6217C33M5G  [SOT-23-5_L3.0-W1.7-P0.95-LS2.8-BR]
U13  SMTWEM220STR  [SMD-1_BD4.4-D2.8]
U14  SMTWEM220STR  [SMD-1_BD4.4-D2.8]
U15  DW01  [SOT-23-6_L2.9-W1.6-P0.95-LS2.8-BL]
U37  -  [2MM POGPIN母座]
U38  -  [2MM POGPIN母座]
U39  -  [2MM POGPIN母座]
sheet 编码器
C22  100nF  [C0402]
U7  -  [AS5047P-OPPOSITE-01]

## Library data of the parts
U29-U32 = SMTWEM220STR: LCSC Part Name: YIYUAN(怡远)M2 贴片螺母 L=2mm铁镀锡SMTWEM220STR; Supplier Part: C3020124; Manufacturer: Sinhoo(雄和远景); JLCPCB Part Class: 扩展库; Datasheet: https://atta.szlcsc.com/upload/public/pdf/source/20221206/2BC8988D03997B4CCCD80A1D6E0F4448.pdf; Supplier: LCSC
C1 C7 C18 C23 C24 C26 C30 C34 C36 = CL05A106MP5NUNC: 容值:10uF;精度:±20%;额定电压:10V;材质(温度系数):X5R;; LCSC Part Name: 10uF ±20% 10V; Supplier Part: C315248; Manufacturer: SAMSUNG(三星); Supplier Footprint: 0402; JLCPCB Part Class: Extended Part; Datasheet: https://atta.szlcsc.com/upload/public/pdf/source/20200102/C478861_C4302703595930F3C0E62DAD3349F1AA.pdf; Supplier: LCSC; Tolerance: ±20%; Voltage Rated: 10V; Temperature Coefficient: X5R
C2 C14 C16 = 0402F105M160NT: 温度系数:Y5V;精度:±20%;容值:1uF;额定电压:16V;; LCSC Part Name: 1uF(105) ±20% 16V; Supplier Part: C1582; Manufacturer: FH(风华); Supplier Footprint: 0402; JLCPCB Part Class: Extended Part; Datasheet: https://atta.szlcsc.com/upload/public/pdf/source/20170923/C1582_1506149281627988389.pdf; Supplier: LCSC; Temperature Coefficient: Y5V; Tolerance: ±20%; Voltage Rated: 16V
C3 C4 C13 C15 C17 C19-C22 C25 C35 C37-C39 = 0402B104J250NT: 容值:100nF;精度:±5%;额定电压:25V;材质(温度系数):X7R;; LCSC Part Name: 100nF ±5% 25V; Supplier Part: C301928; Manufacturer: FH(风华); Supplier Footprint: 0402; JLCPCB Part Class: Extended Part; Datasheet: https://atta.szlcsc.com/upload/public/pdf/source/20181030/C301928_67246FA88671EF9CE9E8BBAF8F7C8A47.pdf; Supplier: LCSC; Tolerance: ±5%; Voltage Rated: 25V; Temperature Coefficient: X7R
C5 C6 C31 C40-C45 = CAP_0402: Supplier Footprint: 0402
C8 C9 C11 = GRM033R61A104KE15D: 容值:100nF;精度:±10%;额定电压:10V;材质(温度系数):X5R;; LCSC Part Name: 100nF ±10% 10V; Supplier Part: C76934; Manufacturer: muRata(村田); Supplier Footprint: 0201; JLCPCB Part Class: Extended Part; Datasheet: https://atta.szlcsc.com/upload/public/pdf/source/20180307/C76934_15204090982891407723.pdf; Supplier: LCSC; Tolerance: ±10%; Voltage Rated: 10V; Temperature Coefficient: X5R
C10 C12 = CC0402GRNPO9BN150: 温度系数:NP0;精度:±2%;电容体长:-;电容体宽:-;电容体厚度:-;容值:15pF;额定电压:50V;; LCSC Part Name: 15pF ±2% 50V; Supplier Part: C325460; Manufacturer: YAGEO(国巨); Supplier Footprint: 0402; JLCPCB Part Class: Extended Part; Datasheet: https://atta.szlcsc.com/upload/public/pdf/source/20181031/C325460_18E37ABBA80C9D8F15CF5120A4DAF78B.pdf; Supplier: LCSC; Temperature Coefficient: NP0; Tolerance: ±2%; Voltage Rated: 50V
D1 = LESD8D3.3CAT5G: 极性:Bidirectional;反向关断电压（典型值）:3.3V (Max);击穿电压（最小值）:5V;箝位电压:10V;峰值脉冲电流（10/1000us）:6A;; Supplier Part: C172409; Manufacturer: LRC(乐山无线电); Supplier Footprint: SOD-882; JLCPCB Part Class: Extended Part; Datasheet: https://atta.szlcsc.com/upload/public/pdf/source/20180130/C172409_15172974211921323438.pdf; Supplier: LCSC; Polarity: Bidirectional; Voltage - Reverse Standoff (Typ): 3.3V (Max); Voltage - Breakdown (Min): 5V; Voltage - Clamping (Max) @ Ipp: 10V; Current - Peak Pulse (10/1000μs): 6A
D6 D7 = 1N4148WT: 二极管配置:独立式;功率:200mW;直流反向耐压(Vr):75V;平均整流电流(Io):300mA;正向压降(Vf):1V@10mA;反向电流(Ir):5A@75V;反向恢复时间(trr):4ns;工作温度:-55~+150@(Tj);; LCSC Part Name: 75V 300mA 4ns; Supplier Part: C232841; Manufacturer: onsemi(安森美); Supplier Footprint: SOD-523F; JLCPCB Part Class: Extended Part; Datasheet: https://atta.szlcsc.com/upload/public/pdf/source/20181222/C232841_42C5BA49E5A441BB8F6B91D0F4CD0D51.pdf; Supplier: LCSC; Diode Configuration: 独立式; Power Dissipation: 200mW; Reverse Voltage (Vr): 75V; Average Rectified Current (Io): 300mA; Forward Voltage (Vf@If): 1V@10mA; Reverse Leakage Current: 5A@75V; Reverse Recovery Time (trr): 4ns; Operating Temperature: -55~+150@(Tj)
L1 = MLG1005S2N0BT000: 电感值:2nH;精度:±0.1nH;额定电流:900mA;饱和电流(Isat):-;直流电阻(DCR):70mΩ;; LCSC Part Name: 2nH ±0.1nH 900mA 70mΩ; Supplier Part: C76769; Manufacturer: TDK; Supplier Footprint: 0402; JLCPCB Part Class: Extended Part; Datasheet: https://atta.szlcsc.com/upload/public/pdf/source/20160918/1474166917976.pdf; Supplier: LCSC; Tolerance: ±0.1nH; Rated Current: 900mA; DC Resistance (DCR): 70mΩ; Q @ Freq: 7@100MHz; Frequency - Self Resonant: 7.5GHz
L2 L3 = LQP03TQ9N1H02D: 电感值:9.1nH;精度:±3%;额定电流:250mA;饱和电流(Isat):-;直流电阻(DCR):650mΩ;; LCSC Part Name: 9.1nH ±3%; Supplier Part: C237373; Manufacturer: muRata(村田); Supplier Footprint: 0201; JLCPCB Part Class: Extended Part; Datasheet: https://atta.szlcsc.com/upload/public/pdf/source/20190906/C426324_E625012984D9CF3790F7AD1737FAB225.pdf; Supplier: LCSC; Tolerance: ±3%; Rated Current: 250mA; DC Resistance (DCR): 650mΩ; Q @ Freq: 17@500MHz; Frequency - Self Resonant: 4.5GHz
R1 R17 R31 = RC0402JR-070RL: 电阻类型:厚膜电阻;阻值:0Ω;精度:-;功率:62.5mW;温度系数:-;最大工作电压:50V;工作温度范围:-55~+155;; LCSC Part Name: 0Ω 62.5mW; Supplier Part: C60485; Manufacturer: YAGEO(国巨); Supplier Footprint: 0402; JLCPCB Part Class: Extended Part; Datasheet: https://atta.szlcsc.com/upload/public/pdf/source/20170428/1493376821608.pdf; Supplier: LCSC; Type: 厚膜电阻; Power(Watts): 62.5mW; Overload Voltage (Max): 50V; Operating Temperature Range: -55~+155
R2 R3 R5 R6 R14-R16 R21-R27 R33 R34 = Res_0402: Supplier Footprint: 0402
R4 R7-R13 R28 = AC0402DR-0710KL: 电阻类型:厚膜电阻;阻值:10kΩ;精度:±0.5%;功率:62.5mW;温度系数:±100ppm/;最大工作电压:50V;工作温度范围:-55~+155;; LCSC Part Name: 10kΩ ±0.5% 62.5mW; Supplier Part: C226679; Manufacturer: YAGEO(国巨); Supplier Footprint: 0402; JLCPCB Part Class: Extended Part; Datasheet: https://atta.szlcsc.com/upload/public/pdf/source/20190301/C226679_A7DB8938E16F4B77CA52DD9CA637BFF1.pdf; Supplier: LCSC; Type: 厚膜电阻; Tolerance: ±0.5%; Power(Watts): 62.5mW; Temperature Coefficient: ±100ppm/; Overload Voltage (Max): 50V; Operating Temperature Range: -55~+155
RF1 = KH-IPEX4-2020: 连接器类型:板端;接口类型:内针;端口数量:1;接口直径:1.5mm;接口长度/高度:-;频率-最大值:3GHz;射频系列:IPEX;阻抗:50Ω;样式:-;工作温度范围:-40℃~+90℃;; LCSC Part Name: IPEX 内针; Supplier Part: C530666; Manufacturer: kinghelm(金航标); Supplier Footprint: SMD; JLCPCB Part Class: 扩展库; Datasheet: https://atta.szlcsc.com/upload/public/pdf/source/20200512/C530666_73AD8E68D965007C672E9CE817423592.pdf; Supplier: LCSC; Connector Type: 板端; Interface Type: 内针; Number of Ports: 1; Interface Diameter: 1.5mm; Frequency-Max: 3GHz; RF Series: IPEX; Impedance: 50Ω; Operating Temperature Range: -40℃~+90℃
U1 = ESP32-S3(R8): 应用领域:蓝牙,WiFi;频率范围:2.412GHz~2.484GHz;数据速率:150Mbps;灵敏度:-98.4dBm;接口:I2C,I2S,SPI,UART,USB;; Supplier Part: C2913194; Manufacturer: ESPRESSIF(乐鑫); Supplier Footprint: QFN-56(7x7); Datasheet: https://atta.szlcsc.com/upload/public/pdf/source/20231007/CDA236FFCB3F25B7D5220D2CA9867287.pdf; Supplier: LCSC; Applications: 蓝牙,WiFi; Operating Voltage: 3.3V; Frequency Range: 2.412GHz~2.484GHz; Data Rate: 150Mbps; Sensitivity: -98.4dBm; Interface: I2C,I2S,SPI,UART,USB; Output Power: 21dBm; Operating Temperature: -40℃~+85℃
U2 = ESP32S3-8线FLASH
U33-U39 = POGPIN母座
X1 = X322540MPB4SI: 晶振类型:贴片无源晶振;频率:40MHz;频率公差:±10ppm;频率稳定度:±30ppm;负载电容:15pF;工作温度:-40~+85;; LCSC Part Name: 40MHz ±10ppm 15pF; Supplier Part: C9010; Manufacturer: YXC扬兴科技; Supplier Footprint: SMD3225-4P; JLCPCB Part Class: Extended Part; Datasheet: https://atta.szlcsc.com/upload/public/pdf/source/20210329/C112971_1F611BDC486E193C1706F6D8EB5AA189.pdf; Supplier: LCSC; Crystal Type: 贴片无源晶振; Frequency Tolerance: ±10ppm; Frequency Stability: ±30ppm; Load Capacitance: 15pF; Operating Temperature: -40~+85
U5 = TMC6300
U6 = 3Pin焊接接口
L5 = MLF2012A3R3JT000: 电感值:3.3uH;精度:±5%;额定电流:50mA;饱和电流(Isat):-;直流电阻(DCR):280mΩ;; LCSC Part Name: 3.3uH ±5% 50mA 280mΩ; Supplier Part: C275371; Manufacturer: TDK; Supplier Footprint: 0805; JLCPCB Part Class: 扩展库; Datasheet: https://atta.szlcsc.com/upload/public/pdf/source/20181112/C275371_AD07E28091BE16956E0767117C958520.pdf; Supplier: LCSC; Tolerance: ±5%; Rated Current: 50mA; DC Resistance (DCR): 280mΩ; Q @ Freq: 45@10MHz; Frequency - Self Resonant: 60MHz
Q6 = MMBT4403: 晶体管类型:PNP;集射极击穿电压(Vceo):40V;集电极电流(Ic):600mA;功率(Pd):300mW;集电极-发射极饱和电压(VCE(sat)@Ic,Ib):400mV@150mA,15mA;直流电流增益(hFE@Ic,Vce):100@150mA,2V;特征频率(fT):200MHz;工作温度:+150@(Tj);; LCSC Part Name: MMBT4403 100~300 100~300; Supplier Part: C8513; Manufacturer: CJ（江苏长电/长晶）; Supplier Footprint: SOT-23(SOT-23-3); JLCPCB Part Class: 扩展库; Datasheet: https://atta.szlcsc.com/upload/public/pdf/source/20140815/1457707223746.pdf; Supplier: LCSC; Transistor Type: PNP; Collector-Emitter Breakdown Voltage (Vceo): 40V; Collector Current (Ic): 600mA; Power Dissipation (Pd): 300mW; Collector-Emitter Saturation Voltage (VCE(sat)@Ic,Ib): 400mV@150mA,15mA; DC Current Gain (hFE@Ic,Vce): 100@150mA,2V; Transition Frequency (fT): 200MHz; Operating Temperature: +150@(Tj)
R29 = ERJ2GEJ822X: LCSC Part Name: 8.2KΩ(822) ±5%; Supplier Part: C400531; Manufacturer: PANASONIC(松下); Supplier Footprint: 0402; JLCPCB Part Class: 扩展库; Datasheet: https://atta.szlcsc.com/upload/public/pdf/source/20190625/C400531_E52FC70D1FB376A49DEE8DACC3F32231.pdf; Supplier: LCSC
R30 R32 = ERJPA2J101X: 阻值:100Ω;精度:±5%;功率:200mW;温度系数:±200ppm/;最大工作电压:-;工作温度范围:-55~+155;; LCSC Part Name: 100Ω ±5% 200mW; Supplier Part: C427204; Manufacturer: PANASONIC(松下); Supplier Footprint: 0402; JLCPCB Part Class: 扩展库; Datasheet: https://atta.szlcsc.comnull; Supplier: LCSC; Tolerance: ±5%; Power(Watts): 200mW; Temperature Coefficient: ±200ppm/; Operating Temperature Range: -55~+155
U20-U23 U25-U28 = 1P焊接接口
U24 = HX711: A/D 位数:24;采样率（sps）:10,80;输入数:2;输入类型:Differential;; Supplier Part: C43656; Manufacturer: AVIA(海芯科技); Supplier Footprint: SOP-16_150mil; JLCPCB Part Class: 扩展库; Datasheet: https://atta.szlcsc.com/upload/public/pdf/source/20201105/C43656_14FD91CAE53E7DB415D03EABCB162D83.pdf; Supplier: LCSC; Number of Bits: 24; Sampling Rate (Per Second): 10,80; Number of Inputs: 2; Input Type: Differential; Voltage - Supply: 2.6V~5.5V
D2 = 1N5819WS_C191023: 正向压降(Vf):600mV@1A;直流反向耐压(Vr):40V;平均整流电流(Io):1A;; LCSC Part Name: 电压:40V 电流:1A; Supplier Part: C191023; Manufacturer: Hottech(合科泰); Supplier Footprint: SOD-323; JLCPCB Part Class: 基础库; Datasheet: https://atta.szlcsc.com/upload/public/pdf/source/20220428/3CB86FD8D28D653594B4E35F9D5AEFD9.pdf; Supplier: LCSC; Forward Voltage (Vf@If): 600mV@1A; Reverse Voltage (Vr): 40V; Average Rectified Current (Io): 1A
L4 = FTC252012S100MBCA: 电感值:10uH;精度:±20%;额定电流:1.2A;饱和电流(Isat):1.6A;类型:一体成型电感;; LCSC Part Name: 10uH ±20% 1.6A; Supplier Part: C5832376; Manufacturer: cjiang(长江微电); Supplier Footprint: SMD,2x2.5mm; JLCPCB Part Class: 扩展库; Datasheet: https://atta.szlcsc.com/upload/public/pdf/source/20230602/8FFEDA9C0247A92A0D4B67554BFE4091.pdf; Supplier: LCSC; Tolerance: ±20%; Rated Current: 1.2A; Saturation Current (Isat): 1.6A; DC Resistance (DCR): 330mΩ; Type: 一体成型电感
Q1 Q4 = 3401_C239055: 类型:P沟道;漏源电压(Vdss):30V;连续漏极电流(Id):4.2A;功率(Pd):1.2W;导通电阻(RDS(on)@Vgs,Id):55mΩ@10V,4.2A;阈值电压(Vgs(th)@Id):1.3V@250A;; LCSC Part Name: P沟道 30V 4.2A; Supplier Part: C239055; Manufacturer: GOFORD(谷峰); Supplier Footprint: SOT-23(SOT-23-3); JLCPCB Part Class: Extended Part; Datasheet: https://atta.szlcsc.com/upload/public/pdf/source/20180619/C239055_DDCD8D435643D304BC40BD7DEC0BB420.pdf; Supplier: LCSC; Type: P沟道; Drain Source Voltage (Vdss): 30V; Continuous Drain Current (Id): 4.2A; Power Dissipation (Pd): 1.2W; Drain Source On Resistance (RDS(on)@Vgs,Id): 55mΩ@10V,4.2A; Gate Threshold Voltage (Vgs(th)@Id): 1.3V@250A
Q2 Q5 = LMUN2212LT1G: 晶体管类型:1个NPN-预偏置;功率(Pd):246mW;集电极电流(Ic):100mA;集射极击穿电压(Vceo):50V;; LCSC Part Name: 1个NPN-预偏置 100mA 50V; Supplier Part: C43984; Manufacturer: LRC(乐山无线电); Supplier Footprint: SOT-23(SOT-23-3); JLCPCB Part Class: Extended Part; Datasheet: https://atta.szlcsc.com/upload/public/pdf/source/20171014/C43984_15079757509251038527.pdf; Supplier: LCSC; Transistor Type: 1个NPN-预偏置; Power Dissipation (Pd): 246mW; Collector Current (Ic): 100mA; Collector-Emitter Breakdown Voltage (Vceo): 50V
U8 = SY7200AABC: 30V 2A LED驱动 升压 效率高达96% 软启动 LED开路保护; Supplier Part: C107309; Manufacturer: silergy(矽力杰); Supplier Footprint: SOT-23-6; JLCPCB Part Class: 扩展库; Datasheet: https://atta.szlcsc.com/upload/public/pdf/source/20170925/C107309_1506321334417990079.pdf; Supplier: LCSC
U9 = 屏幕焊线接口2
U10 U11 U13 U14 = SMTWEM220STR: LCSC Part Name: YIYUAN(怡远)M2 贴片螺母 L=2mm铁镀锡SMTWEM220STR; Supplier Part: C5301775; Manufacturer: YIYUAN(怡远); JLCPCB Part Class: 扩展库; Datasheet: https://atta.szlcsc.com/upload/public/pdf/source/20221206/2BC8988D03997B4CCCD80A1D6E0F4448.pdf; Supplier: LCSC
D3-D5 = 1N4148WS_C727111: 二极管配置:独立式;功率:400mW;直流反向耐压(Vr):100V;平均整流电流(Io):300mA;正向压降(Vf):1.25V@150mA;反向电流(Ir):1A@75V;反向恢复时间(trr):8ns;工作温度:-55~+150@(Tj);; LCSC Part Name: 100V 300mA 8ns; Supplier Part: C727111; Manufacturer: TWGMC(台湾迪嘉); Supplier Footprint: SOD-323; JLCPCB Part Class: Extended Part; Datasheet: https://atta.szlcsc.com/upload/public/pdf/source/20200828/C727111_E7108F014A9288D320E3440593CCDF54.pdf; Supplier: LCSC; Diode Configuration: 独立式; Power Dissipation: 400mW; Reverse Voltage (Vr): 100V; Average Rectified Current (Io): 300mA; Forward Voltage (Vf@If): 1.25V@150mA; Reverse Leakage Current: 1A@75V; Reverse Recovery Time (trr): 8ns; Operating Temperature: -55~+150@(Tj)
Q3 = FS8205A: 类型:2个N沟道;漏源电压(Vdss):20V;连续漏极电流(Id):6A;功率(Pd):1.5W;导通电阻(RDS(on)@Vgs,Id):19.5mΩ@4.5V,3A;阈值电压(Vgs(th)@Id):700mV@250uA;; LCSC Part Name: 2个N沟道 耐压:20V 电流:6A; Supplier Part: C2830320; Manufacturer: TECH PUBLIC(台舟); Supplier Footprint: SOT-23-6; JLCPCB Part Class: 扩展库; Datasheet: https://atta.szlcsc.com/upload/public/pdf/source/20210810/F53B6D4E8755A1F8E11BAF814CE98E6A.pdf; Supplier: LCSC; Type: 2个N沟道; Drain Source Voltage (Vdss): 20V; Continuous Drain Current (Id): 6A; Power Dissipation (Pd): 1.5W; Drain Source On Resistance (RDS(on)@Vgs,Id): 19.5mΩ@4.5V,3A; Gate Threshold Voltage (Vgs(th)@Id): 700mV@250uA; Total Gate Charge (Qg@Vgs): 5.7nC@10V; Input Capacitance (Ciss@Vds): 466pF@10V; Reverse Transfer Capacitance (Crss@Vds): 58pF@10V; Operating Temperature: -55℃~+150℃@(Tj)
U12 = ME6217C33M5G: 输出类型:固定;输出极性:正;输出通道数:1;最大输入电压:7V;输出电压:3.3V;压差:180mV@(300mA);静态电流(地电流):-;输出电流:800mA;电源纹波抑制比(PRSS):65dB@(1kHz);; LCSC Part Name: Vin=7V Vout=3.3V 800mA 65dB@(1kHz); Supplier Part: C427602; Manufacturer: MICRONE(南京微盟); Supplier Footprint: SOT-23-5; JLCPCB Part Class: 扩展库; Datasheet: https://atta.szlcsc.com/upload/public/pdf/source/20190910/C427602_D4B9162A2E9D9EF57C60010DFDECEF37.pdf; Supplier: LCSC; Output Type: 固定; Output Polarity: 正; Number of Outputs: 1; Maximum Input Voltage: 7V; Output Voltage: 3.3V; Dropout Voltage: 180mV@(300mA); Output Current: 800mA; Power Supply Rejection Ratio (PRSS): 65dB@(1kHz)
U15 = DW01_C917079: 电池类型:锂离子/聚合物;电池节数:1;; Supplier Part: C917079; Manufacturer: JSMSEMI(杰盛微); Supplier Footprint: SOT-23-6; JLCPCB Part Class: 扩展库; Datasheet: https://atta.szlcsc.com/upload/public/pdf/source/20230807/0171ABC52D546C56F1605FBA17BFC812.pdf; Supplier: LCSC; The Chip Type: 电池保护芯片; Type of Battery: 锂离子/聚合物; Number of Cells: 1; Operating Temperature: -40℃~+85℃
U7 = AS5047P-反方向装配

## Nets
3V3: C1.2 C2.2 C3.1 C5.2 C6.2 C7.2 C13.1 C15.1 C22.1 C30.1 C34.2 C35.1 D1.2 L1.1 Q6.2(E) R2.1 R4.2 R7.2 R17.2 U1.20(VDD3P3_RTC) U1.46(VDD3P3_CPU) U1.55(VDDA) U1.56(VDDA) U7.11(VDD) U7.12(VDD3V3) U12.5(VOUT) U24.1(VSUP) U24.15(RATE) U24.16(DVDD)
AGND: C34.1 C35.2 C36.1 C37.2 C38.2 R29.1 R31.1 U21.1 U24.5(AGND) U24.9(INNB) U24.10(INPB) U24.14(XI) U26.1
GND: C1.1 C2.1 C3.2 C4.2 C5.1 C6.1 C7.1 C8.1 C9.1 C10.1 C11.1 C12.1 C13.2 C14.1 C15.2 C16.1 C17.2 C18.1 C19.1 C21.1 C22.2 C23.2 C24.1 C25.1 C26.2 C30.2 C40.1 C41.1 C42.1 C43.1 C44.1 C45.1 D1.1 Q2.2(E) Q3.3(S2) Q5.2(E) R8.2 R9.2 R10.2 R11.2 R12.2 R13.2 R14.1 R22.1 R26.1 R31.2 R34.1 RF1.2 RF1.3 RF1.4 U1.57(GND) U2.B3(VSS1) U2.C1(VSS2) U2.E5(VSS3) U5.8(GND) U5.9(GND) U5.14(GND) U5.16(BRUV) U5.20(BRW) U5.21(GND) U7.5(Test) U7.13(GND) U8.2(GND) U9.8 U12.2(VSS) U29.1 U30.1 U31.1 U32.1 U38.1 X1.2(GND) X1.4(GND)
VBAT: C18.2 C19.2 C20.2 C26.1 C40.2 C41.2 C42.2 C43.2 C44.2 C45.2 Q1.2(S) Q4.3(D) R15.1 R23.2 U5.18(VS) U12.1(VIN) U12.3(CE)
VDD_SPI: C16.2 C17.1 R5.2 R6.2 U1.29(VDD_SPI) U2.B4(VCC1) U2.D1(VCC2) U2.E4(VCC3)
AS5047P_CLK: U1.17(GPIO12) U7.2(CLK)
AS5047P_MISO: U1.18(GPIO13) U7.3(MISO)
AS5047P_MOSI: U1.16(GPIO11) U7.4(MOSI)
AS5047P_SS: U1.15(GPIO10) U7.1(CSn)
BAT_ADC: R23.1 R26.2 U1.12(GPIO7)
CHIP_PU: C14.2 R4.1 U1.4(CHIP_PU) U34.1
CHRG: U1.47(MTDI)
GPIO0: D6.2(A) U1.5(GPIO0)
GPIO1: U1.6(GPIO1) U8.4(EN/PWM)
GPIO2: U1.7(GPIO2) U9.5
GPIO3: U1.8(GPIO3) U9.6
GPIO4: R7.1 U1.9(GPIO4) U5.11(VIO/STDBY)
GPIO5: R11.1 U1.10(GPIO5) U5.10(VL)
GPIO6: R13.1 U1.11(GPIO6) U5.7(WL)
GPIO8: R12.1 U1.13(GPIO8) U5.5(WH)
GPIO9: R9.1 U1.14(GPIO9) U5.6(UL)
GPIO14: Q2.1(B) U1.19(GPIO14)
GPIO15: R8.1 U1.21(XTAL_32K_P) U5.3(UH)
GPIO16: U1.22(XTAL_32K_N) U9.7
GPIO17: R10.1 U1.23(GPIO17) U5.4(VH)
GPIO18: U1.24(GPIO18) U11.1
GPIO19: U1.25(GPIO19)
GPIO20: U1.26(GPIO20)
GPIO21: U1.27(GPIO21) U9.4
GPIO38: D3.2(A) U1.43(GPIO38)
GPIO39: U1.44(MTCK) U24.11(PD_SCK)
GPIO40: U1.45(MTDO) U24.12(DOUT)
GPIO42: U1.48(MTMS)
GPIO45: R2.2 R33.2 U1.51(GPIO45)
GPIO46: D7.2(A) U1.52(GPIO46)
GPIO47: U1.37(SPICLK_P)
GPIO48: U1.36(SPICLK_N)
LEDA: C23.1 D2.1(K) U8.5(OVP) U9.2
LEDK: R14.2 U8.3(FB) U9.3
SCREEN_3V3: C24.2 C25.2 L4.2 R17.1 U8.6(IN) U9.1
SPI_CLK: U1.33(SPICLK) U2.B2(SCLK)
SPI_CS0: U1.32(SPICS0) U2.C2(CS#)
SPI_D: U1.35(SPID) U2.D3(SI(IO0))
SPI_DQS: U1.42(GPIO37) U2.C3(DQS)
SPI_HD: U1.30(SPIHD) U2.D4(IO3)
SPI_IO4: U1.38(GPIO33) U2.D5(IO4)
SPI_IO5: U1.39(GPIO34) U2.E3(IO5)
SPI_IO6: U1.40(GPIO35) U2.E2(IO6)
SPI_IO7: U1.41(GPIO36) U2.E1(IO7)
SPI_Q: U1.34(SPIQ) U2.D2(SO(IO1))
SPI_WP: U1.31(SPIWP) U2.C4(IO2)
STRAIN_E+: C36.2 C37.1 L5.1 U20.1 U25.1
STRAIN_S+: R32.1 U22.1 U23.1
STRAIN_S-: R30.1 U27.1 U28.1
U0RXD: U1.50(U0RXD) U35.1
U0TXD: R3.2 U36.1
XTAL_N: C12.2 U1.53(XTAL_N) X1.3(OSC2)
XTAL_P: R1.2 U1.54(XTAL_P)
$1N10080: C10.2 R1.1 X1.1(OSC1)
$1N35324: C4.1 L1.2 U1.2(VDD3P3) U1.3(VDD3P3)
$1N35583: R3.1 U1.49(U0TXD)
$1N36716: C9.2 L3.2 U1.1(LNA_IN)
$1N36861: C8.2 L2.2 L3.1 RF1.1
$1N37088: R5.1 U2.A4(RESET#)
$1N37209: R6.1 U2.C5(WP#)
$1N41094: C11.2 L2.1
$1N51986: D6.1(C) D7.1(C) U33.1
$2N26059: C20.1 U5.2(VCP)
$2N26420: U5.15(U) U6.1
$2N26421: U5.17(V) U6.2
$2N26422: U5.1(W) U6.3
$2N26688: C21.2 U5.13(1V8OUT)
$3N10252: D2.2(A) L4.1 U8.1(LX)
$3N10793: Q2.3(C) R16.1
$3N10800: Q1.3(D) U10.1
$3N10863: Q1.1(G) R15.2 R16.2
$4N9091: Q3.6(G1) U15.1(OD)
$4N9094: Q3.4(G2) U15.3(OC)
$4N9173: C31.1 R21.1 U15.5(VDD)
$4N9236: C31.2 Q3.1(S1) U13.1 U15.6(VSS)
$4N9274: R22.2 U15.2(CSI)
$4N9669: D4.2(A) R27.1
$4N9670: D3.1(C) D4.1(C) U39.1
$4N9672: D5.2(A) R33.1 R34.2
$4N9674: D5.1(C) Q5.1(B)
$4N9682: Q4.1(G) R24.2 R25.2
$4N9741: Q5.3(C) R25.1 R27.2
$4N14277: Q4.2(S) R21.2 R24.1 U14.1 U37.1
$6N754: R28.1 R29.2 U24.4(VFB)
$6N862: C38.1 U24.6(VBG)
$6N888: C39.1 R30.2 U24.7(INNA)
$6N899: C39.2 R32.2 U24.8(INPA)
$6N1762: Q6.1(B) U24.2(BASE)
$6N1789: L5.2 Q6.3(C) R28.2 U24.3(AVDD)

Not connected (* = marked no-connect by the designer): Q3 2(D1/D2) 5(D1/D2)*; U1 28(SPICS1)*; U2 A2(NC1)* A3(NC2)* A5(ECS#)* B1(NC3)* B5(NC4)*; U5 12(DIAG)*; U7 6(B)* 7(A)* 8(W/PWM)* 9(V)* 10(U)* 14(I)*; U12 4(NC)*; U15 4(TD); U24 13(XO)*

## Notes on the sheets
sheet 4
- 电池端口
- 充电端口
